# Altium project NanoVTX.PrjPcb
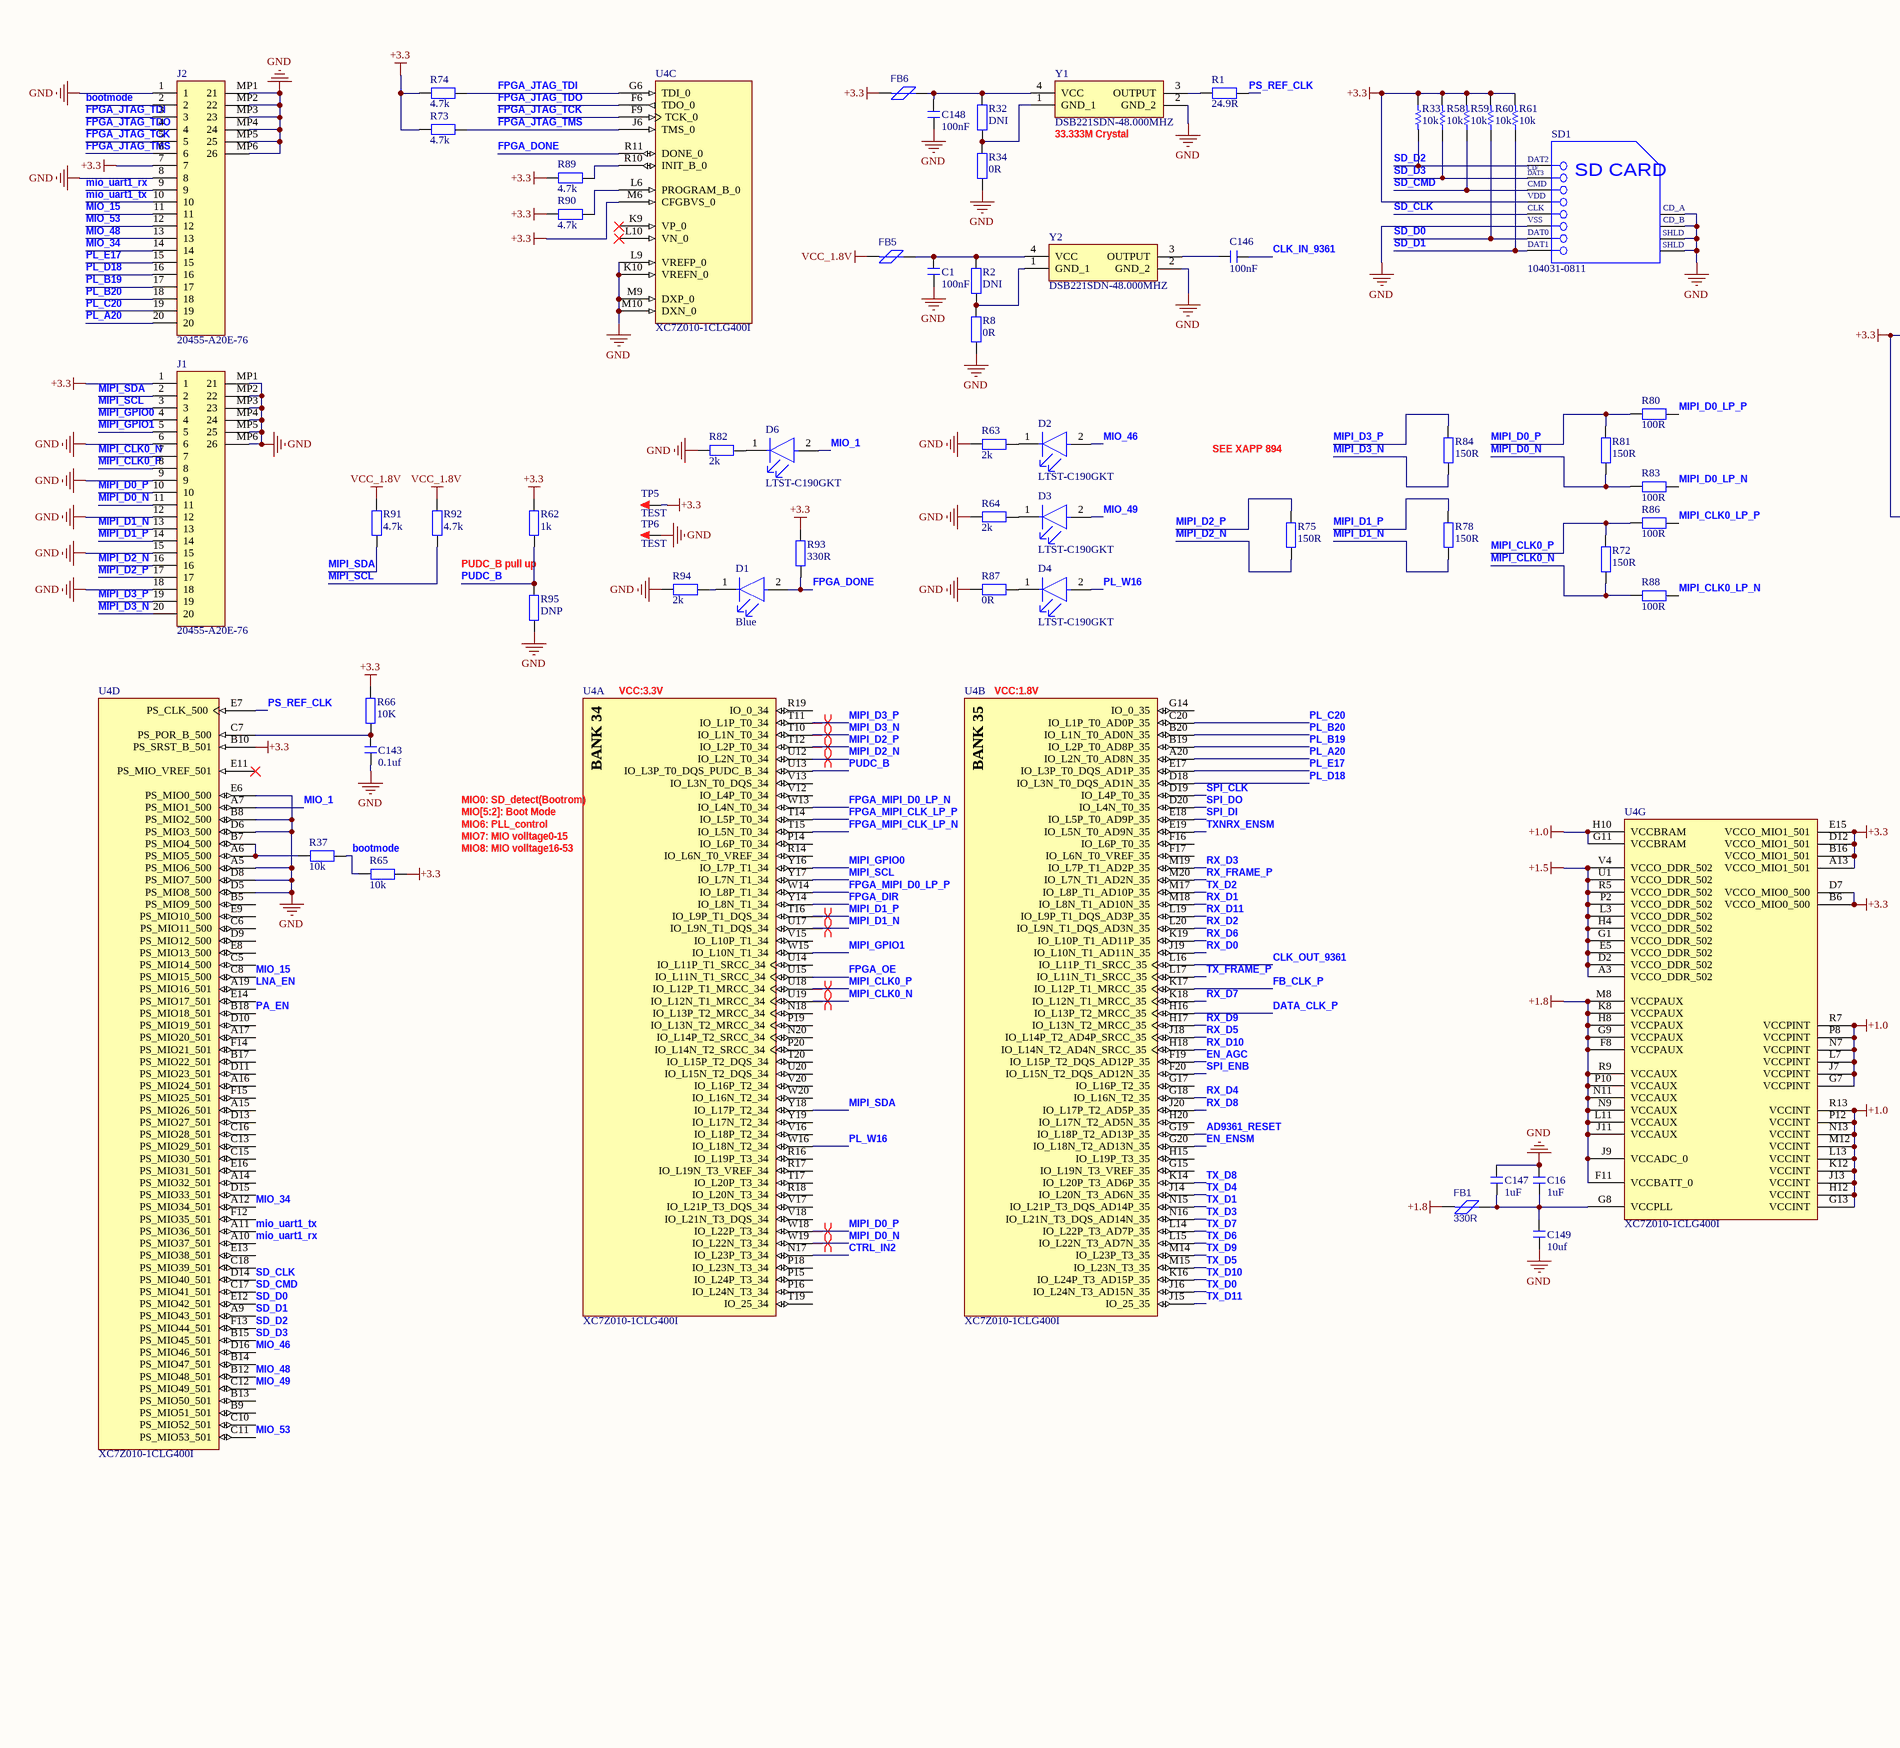
[diagram p0: CoreBoard.SchDoc, left]
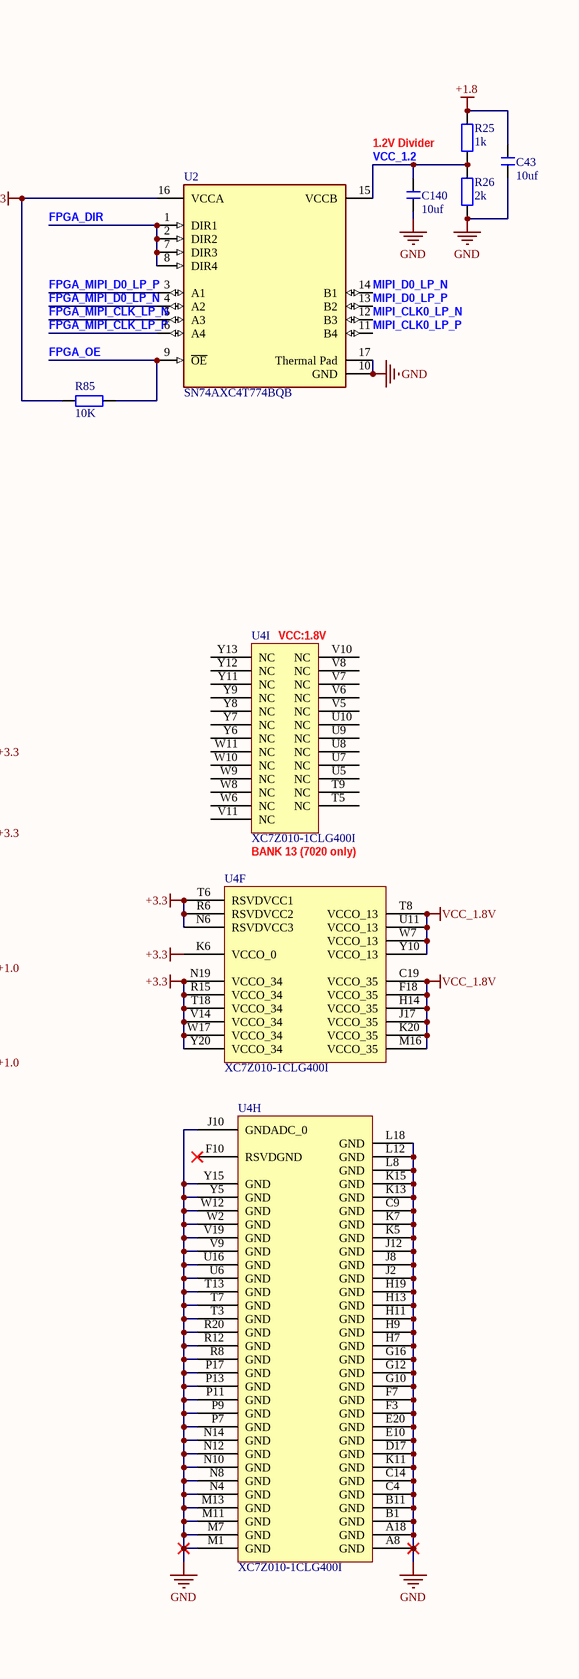
[diagram p1: CoreBoard.SchDoc, right]
5 sheets, 295 parts. Net scope: global (net labels, ports and power ports of the same name join across sheets).
Board file: OFDMT1.PcbDoc
Sheets:
  CoreBoard.SchDoc
  AD9361.SchDoc
  DDRmem.SchDoc
  Power.SchDoc
  RFFE.SchDoc

## Sheet CoreBoard.SchDoc
size C; SheetNumber: 1; SheetTotal: 5

### Parts
C1  100nF  [CAP_0402]
C16  1uF  [CAP_0201]
C43  10uf  [CAP_0402]
C140  10uf  [CAP_0402]
C143  0.1uf  [CAP_0402]
C146  100nF  [CAP_0402]
C147  1uF  [CAP_0201]
C148  100nF  [CAP_0402]
C149  10uf  [CAP_0402]
D1  Blue  [FP-LTST-C190GKT-MFG]
D2  LTST-C190GKT  [FP-LTST-C190GKT-MFG]
D3  LTST-C190GKT  [FP-LTST-C190GKT-MFG]
D4  LTST-C190GKT  [FP-LTST-C190GKT-MFG]
D6  LTST-C190GKT  [FP-LTST-C190GKT-MFG]
FB1  330R  [RES_0201]
FB5  BLM15PX331SN1D  [RES_0402]  (value not drawn)
FB6  BLM15PX331SN1D  [RES_0402]  (value not drawn)
J1  20455-A20E-76  [20455A20E76]
J2  20455-A20E-76  [20455A20E76]
R1  24.9R  [RES_0402]
R2  DNI  [RES_0402]
R8  0R  [RES_0402]
R25  1k  [RES_0402]
R26  2k  [RES_0402]
R32  DNI  [RES_0402]
R33  10k  [RES_0402]
R34  0R  [RES_0402]
R37  10k  [RES_0201]
R58  10k  [RES_0402]
R59  10k  [RES_0402]
R60  10k  [RES_0402]
R61  10k  [RES_0402]
R62  1k  [RES_0201]
R63  2k  [RES_0402]
R64  2k  [RES_0402]
R65  10k  [RES_0201]
R66  10K  [RES_0201]
R72  150R  [RES_0201]
R73  4.7k  [RES_0201]
R74  4.7k  [RES_0201]
R75  150R  [RES_0201]
R78  150R  [RES_0201]
R80  100R  [RES_0201]
R81  150R  [RES_0201]
R82  2k  [RES_0402]
R83  100R  [RES_0201]
R84  150R  [RES_0201]
R85  10K  [RES_0201]
R86  100R  [RES_0201]
R87  0R  [RES_0201]
R88  100R  [RES_0201]
R89  4.7k  [RES_0201]
R90  4.7k  [RES_0201]
R91  4.7k  [RES_0402]
R92  4.7k  [RES_0402]
R93  330R  [RES_0402]
R94  2k  [RES_0402]
R95  DNP  [RES_0201]
SD1  104031-0811  [MOLX-104031-0811_V]
TP5  TEST  [TEST 0.8]
TP6  TEST  [TEST 0.8]
U2  SN74AXC4T774BQB  [FP-BQB0016A-MFG]
U4  XC7Z010-1CLG400I  [CLG400]  (parts A,B,C,D,F,G,H,I of 9)
Y1  DSB221SDN-48.000MHZ  [DSB221SDN48000MHZ]
Y2  DSB221SDN-48.000MHZ  [DSB221SDN48000MHZ]

### Nets
+1.0: U4.G7(VCCPINT) U4.G11(VCCBRAM) U4.G13(VCCINT) U4.H10(VCCBRAM) U4.H12(VCCINT) U4.J7(VCCPINT) U4.J13(VCCINT) U4.K12(VCCINT) U4.L7(VCCPINT) U4.L13(VCCINT) U4.M12(VCCINT) U4.N7(VCCPINT) U4.N13(VCCINT) U4.P8(VCCPINT) U4.P12(VCCINT) U4.R7(VCCPINT) U4.R13(VCCINT)
+1.5: U4.A3(VCCO_DDR_502) U4.D2(VCCO_DDR_502) U4.E5(VCCO_DDR_502) U4.G1(VCCO_DDR_502) U4.H4(VCCO_DDR_502) U4.L3(VCCO_DDR_502) U4.P2(VCCO_DDR_502) U4.R5(VCCO_DDR_502) U4.U1(VCCO_DDR_502) U4.V4(VCCO_DDR_502)
+1.8: C43.1 FB1.1 FB5.1 R25.1 R91.1 R92.1 U4.C19(VCCO_35) U4.F8(VCCPAUX) U4.F11(VCCBATT_0) U4.F18(VCCO_35) U4.G9(VCCPAUX) U4.H8(VCCPAUX) U4.H14(VCCO_35) U4.J9(VCCADC_0) U4.J11(VCCAUX) U4.J17(VCCO_35) U4.K8(VCCPAUX) U4.K20(VCCO_35) U4.L11(VCCAUX) U4.M8(VCCPAUX) U4.M16(VCCO_35) U4.N9(VCCAUX) U4.N11(VCCAUX) U4.P10(VCCAUX) U4.R9(VCCAUX) U4.T8(VCCO_13) U4.U11(VCCO_13) U4.W7(VCCO_13) U4.Y10(VCCO_13)  [also labelled VCC_1.8V]
+3.3: FB6.1 J1.1 J2.7 R33.1 R58.2 R59.2 R60.2 R61.2 R62.2 R65.2 R66.2 R73.1 R74.1 R85.2 R89.2 R90.2 R93.2 SD1.4(VDD) TP5.1 U2.16(VCCA) U4.A13(VCCO_MIO1_501) U4.B6(VCCO_MIO0_500) U4.B10(PS_SRST_B_501) U4.B16(VCCO_MIO1_501) U4.D7(VCCO_MIO0_500) U4.D12(VCCO_MIO1_501) U4.E15(VCCO_MIO1_501) U4.K6(VCCO_0) U4.M6(CFGBVS_0) U4.N6(RSVDVCC3) U4.N19(VCCO_34) U4.R6(RSVDVCC2) U4.R15(VCCO_34) U4.T6(RSVDVCC1) U4.T18(VCCO_34) U4.V14(VCCO_34) U4.W17(VCCO_34) U4.Y20(VCCO_34)
GND: C1.2 C16.2 C43.2 C140.2 C143.2 C147.2 C148.1 C149.2 J1.6 J1.9 J1.12 J1.15 J1.18 J1.MP1(21) J1.MP2(22) J1.MP3(23) J1.MP4(24) J1.MP5(25) J1.MP6(26) J2.1 J2.8 J2.MP1(21) J2.MP2(22) J2.MP3(23) J2.MP4(24) J2.MP5(25) J2.MP6(26) R8.1 R26.2 R34.1 R63.1 R64.1 R82.1 R87.1 R94.1 R95.1 SD1.6(VSS2) SD1.9(CD_A) SD1.10(CD_B) SD1.11(SHLD1) SD1.12(SHLD2) TP6.1 U2.10(GND) U2.17(Thermal_Pad) U4.A5(PS_MIO6_500) U4.A8(GND) U4.A18(GND) U4.B1(GND) U4.B8(PS_MIO2_500) U4.B11(GND) U4.C4(GND) U4.C9(GND) U4.C14(GND) U4.D5(PS_MIO8_500) U4.D6(PS_MIO3_500) U4.D8(PS_MIO7_500) U4.D17(GND) U4.E6(PS_MIO0_500) U4.E10(GND) U4.E20(GND) U4.F3(GND) U4.F7(GND) U4.G10(GND) U4.G12(GND) U4.G16(GND) U4.H7(GND) U4.H9(GND) U4.H11(GND) U4.H13(GND) U4.H19(GND) U4.J2(GND) U4.J8(GND) U4.J10(GNDADC_0) U4.J12(GND) U4.K5(GND) U4.K7(GND) U4.K10(VREFN_0) U4.K11(GND) U4.K13(GND) U4.K15(GND) U4.L8(GND) U4.L9(VREFP_0) U4.L12(GND) U4.L18(GND) U4.M1(GND) U4.M7(GND) U4.M9(DXP_0) U4.M10(DXN_0) U4.M11(GND) U4.M13(GND) U4.N4(GND) U4.N8(GND) U4.N10(GND) U4.N12(GND) U4.N14(GND) U4.P7(GND) U4.P9(GND) U4.P11(GND) U4.P13(GND) U4.P17(GND) U4.R8(GND) U4.R12(GND) U4.R20(GND) U4.T3(GND) U4.T7(GND) U4.T13(GND) U4.U6(GND) U4.U16(GND) U4.V9(GND) U4.V19(GND) U4.W2(GND) U4.W12(GND) U4.Y5(GND) U4.Y15(GND) Y1.2(GND_2) Y2.2(GND_2)
AD9361_RESET: U4.G19(IO_L18P_T2_AD13P_35)
bootmode: J2.2 R37.2 R65.1
CLK_IN_9361: C146.2
CLK_OUT_9361: U4.L16(IO_L11P_T1_SRCC_35)
CTRL_IN2: U4.N17(IO_L23P_T3_34)
DATA_CLK_P: U4.H16(IO_L13P_T2_MRCC_35)
EN_AGC: U4.F19(IO_L15P_T2_DQS_AD12P_35)
EN_ENSM: U4.G20(IO_L18N_T2_AD13N_35)
FB_CLK_P: U4.K17(IO_L12P_T1_MRCC_35)
FPGA_DIR: U2.1(DIR1) U2.2(DIR2) U2.7(DIR3) U2.8(DIR4) U4.Y14(IO_L8N_T1_34)
FPGA_DONE: D1.2(A) R93.1 U4.R11(DONE_0)
FPGA_JTAG_TCK: J2.5 U4.F9(TCK_0)
FPGA_JTAG_TDI: J2.3 R74.2 U4.G6(TDI_0)
FPGA_JTAG_TDO: J2.4 U4.F6(TDO_0)
FPGA_JTAG_TMS: J2.6 R73.2 U4.J6(TMS_0)
FPGA_MIPI_CLK_LP_N: U2.5(A3) U4.T15(IO_L5N_T0_34)
FPGA_MIPI_CLK_LP_P: U2.6(A4) U4.T14(IO_L5P_T0_34)
FPGA_MIPI_D0_LP_N: U2.4(A2) U4.W13(IO_L4N_T0_34)
FPGA_MIPI_D0_LP_P: U2.3(A1) U4.W14(IO_L8P_T1_34)
FPGA_OE: R85.1 U2.9(~{OE}) U4.U15(IO_L11N_T1_SRCC_34)
LNA_EN: U4.A19(PS_MIO16_501)
MIO_1: D6.2(A) U4.A7(PS_MIO1_500)
MIO_15: J2.11 U4.C8(PS_MIO15_500)
MIO_34: J2.14 U4.A12(PS_MIO34_501)
MIO_46: D2.2(A) U4.D16(PS_MIO46_501)
MIO_48: J2.13 U4.B12(PS_MIO48_501)
MIO_49: D3.2(A) U4.C12(PS_MIO49_501)
MIO_53: J2.12 U4.C11(PS_MIO53_501)
mio_uart1_rx: J2.9 U4.A10(PS_MIO37_501)
mio_uart1_tx: J2.10 U4.A11(PS_MIO36_501)
MIPI_CLK0_LP_N: R88.2 U2.12(B3)
MIPI_CLK0_LP_P: R86.2 U2.11(B4)
MIPI_CLK0_N: J1.7 R72.2 R88.1 U4.U19(IO_L12N_T1_MRCC_34)
MIPI_CLK0_P: J1.8 R72.1 R86.1 U4.U18(IO_L12P_T1_MRCC_34)
MIPI_D0_LP_N: R83.1 U2.14(B1)
MIPI_D0_LP_P: R80.1 U2.13(B2)
MIPI_D0_N: J1.11 R81.2 R83.2 U4.W19(IO_L22N_T3_34)
MIPI_D0_P: J1.10 R80.2 R81.1 U4.W18(IO_L22P_T3_34)
MIPI_D1_N: J1.13 R78.2 U4.U17(IO_L9N_T1_DQS_34)
MIPI_D1_P: J1.14 R78.1 U4.T16(IO_L9P_T1_DQS_34)
MIPI_D2_N: J1.16 R75.2 U4.U12(IO_L2N_T0_34)
MIPI_D2_P: J1.17 R75.1 U4.T12(IO_L2P_T0_34)
MIPI_D3_N: J1.20 R84.2 U4.T10(IO_L1N_T0_34)
MIPI_D3_P: J1.19 R84.1 U4.T11(IO_L1P_T0_34)
MIPI_GPIO0: J1.4 U4.Y16(IO_L7P_T1_34)
MIPI_GPIO1: J1.5 U4.W15(IO_L10N_T1_34)
MIPI_SCL: J1.3 R92.2 U4.Y17(IO_L7N_T1_34)
MIPI_SDA: J1.2 R91.2 U4.Y18(IO_L17P_T2_34)
PA_EN: U4.B18(PS_MIO18_501)
PL_A20: J2.20 U4.A20(IO_L2N_T0_AD8N_35)
PL_B19: J2.17 U4.B19(IO_L2P_T0_AD8P_35)
PL_B20: J2.18 U4.B20(IO_L1N_T0_AD0N_35)
PL_C20: J2.19 U4.C20(IO_L1P_T0_AD0P_35)
PL_D18: J2.16 U4.D18(IO_L3N_T0_DQS_AD1N_35)
PL_E17: J2.15 U4.E17(IO_L3P_T0_DQS_AD1P_35)
PL_W16: D4.2(A) U4.W16(IO_L18N_T2_34)
PS_REF_CLK: R1.2 U4.E7(PS_CLK_500)
PUDC_B: R62.1 R95.2 U4.U13(IO_L3P_T0_DQS_PUDC_B_34)
RX_D0: U4.J19(IO_L10N_T1_AD11N_35)
RX_D1: U4.M18(IO_L8N_T1_AD10N_35)
RX_D2: U4.L20(IO_L9N_T1_DQS_AD3N_35)
RX_D3: U4.M19(IO_L7P_T1_AD2P_35)
RX_D4: U4.G18(IO_L16N_T2_35)
RX_D5: U4.J18(IO_L14P_T2_AD4P_SRCC_35)
RX_D6: U4.K19(IO_L10P_T1_AD11P_35)
RX_D7: U4.K18(IO_L12N_T1_MRCC_35)
RX_D8: U4.J20(IO_L17P_T2_AD5P_35)
RX_D9: U4.H17(IO_L13N_T2_MRCC_35)
RX_D10: U4.H18(IO_L14N_T2_AD4N_SRCC_35)
RX_D11: U4.L19(IO_L9P_T1_DQS_AD3P_35)
RX_FRAME_P: U4.M20(IO_L7N_T1_AD2N_35)
SD_CLK: SD1.5(CLK) U4.D14(PS_MIO40_501)
SD_CMD: R59.1 SD1.3(VSS1) U4.C17(PS_MIO41_501)
SD_D0: R60.1 SD1.7(DAT0) U4.E12(PS_MIO42_501)
SD_D1: R61.1 SD1.8(DAT1) U4.A9(PS_MIO43_501)
SD_D2: R33.2 SD1.1(CD/DAT3) U4.F13(PS_MIO44_501)
SD_D3: R58.1 SD1.2(CMD) U4.B15(PS_MIO45_501)
SPI_CLK: U4.D19(IO_L4P_T0_35)
SPI_DI: U4.E18(IO_L5P_T0_AD9P_35)
SPI_DO: U4.D20(IO_L4N_T0_35)
SPI_ENB: U4.F20(IO_L15N_T2_DQS_AD12N_35)
TX_D0: U4.J16(IO_L24N_T3_AD15N_35)
TX_D1: U4.N15(IO_L21P_T3_DQS_AD14P_35)
TX_D2: U4.M17(IO_L8P_T1_AD10P_35)
TX_D3: U4.N16(IO_L21N_T3_DQS_AD14N_35)
TX_D4: U4.J14(IO_L20N_T3_AD6N_35)
TX_D5: U4.M15(IO_L23N_T3_35)
TX_D6: U4.L15(IO_L22N_T3_AD7N_35)
TX_D7: U4.L14(IO_L22P_T3_AD7P_35)
TX_D8: U4.K14(IO_L20P_T3_AD6P_35)
TX_D9: U4.M14(IO_L23P_T3_35)
TX_D10: U4.K16(IO_L24P_T3_AD15P_35)
TX_D11: U4.J15(IO_25_35)
TX_FRAME_P: U4.L17(IO_L11N_T1_SRCC_35)
TXNRX_ENSM: U4.E19(IO_L5N_T0_AD9N_35)
VCC_1.2: C140.1 R25.2 R26.1 U2.15(VCCB)
NetC1_1: C1.1 FB5.2 R2.2 Y2.4(VCC)
NetC16_1: C16.1 C147.1 C149.1 FB1.2 U4.G8(VCCPLL)
NetC143_1: C143.1 R66.1 U4.C7(PS_POR_B_500)
NetC146_1: C146.1 Y2.3(OUTPUT)
NetC148_2: C148.2 FB6.2 R32.2 Y1.4(VCC)
NetD1_1: D1.1(C) R94.2
NetD2_1: D2.1(C) R63.2
NetD3_1: D3.1(C) R64.2
NetD4_1: D4.1(C) R87.2
NetD6_1: D6.1(C) R82.2
NetR1_1: R1.1 Y1.3(OUTPUT)
NetR2_1: R2.1 R8.2 Y2.1(GND_1)
NetR32_1: R32.1 R34.2 Y1.1(GND_1)
NetR37_1: R37.1 U4.A6(PS_MIO5_500) U4.B7(PS_MIO4_500)
NetR89_1: R89.1 U4.R10(INIT_B_0)
NetR90_1: R90.1 U4.L6(PROGRAM_B_0)

Not connected (* = marked no-connect by the designer): U4 A14(PS_MIO32_501) A15(PS_MIO26_501) A16(PS_MIO24_501) A17(PS_MIO20_501) B5(PS_MIO9_500) B9(PS_MIO51_501) B13(PS_MIO50_501) B14(PS_MIO47_501) B17(PS_MIO22_501) C5(PS_MIO14_500) C6(PS_MIO11_500) C10(PS_MIO52_501) C13(PS_MIO29_501) C15(PS_MIO30_501) C16(PS_MIO28_501) C18(PS_MIO39_501) D9(PS_MIO12_500) D10(PS_MIO19_501) D11(PS_MIO23_501) D13(PS_MIO27_501) D15(PS_MIO33_501) E8(PS_MIO13_500) E9(PS_MIO10_500) E11(PS_MIO_VREF_501)* E13(PS_MIO38_501) E14(PS_MIO17_501) E16(PS_MIO31_501) F10(RSVDGND)* F12(PS_MIO35_501) F14(PS_MIO21_501) F15(PS_MIO25_501) F16(IO_L6P_T0_35) F17(IO_L6N_T0_VREF_35) G14(IO_0_35) G15(IO_L19N_T3_VREF_35) G17(IO_L16P_T2_35) H15(IO_L19P_T3_35) H20(IO_L17N_T2_AD5N_35) K9(VP_0)* L10(VN_0)* N18(IO_L13P_T2_MRCC_34) N20(IO_L14P_T2_SRCC_34) P14(IO_L6P_T0_34) P15(IO_L24P_T3_34) P16(IO_L24N_T3_34) P18(IO_L23N_T3_34) P19(IO_L13N_T2_MRCC_34) P20(IO_L14N_T2_SRCC_34) R14(IO_L6N_T0_VREF_34) R16(IO_L19P_T3_34) R17(IO_L19N_T3_VREF_34) R18(IO_L20N_T3_34) R19(IO_0_34) T5(NC) T9(NC) T17(IO_L20P_T3_34) T19(IO_25_34) T20(IO_L15P_T2_DQS_34) U5(NC) U7(NC) U8(NC) U9(NC) U10(NC) U14(IO_L11P_T1_SRCC_34) U20(IO_L15N_T2_DQS_34) V5(NC) V6(NC) V7(NC) V8(NC) V10(NC) V11(NC) V12(IO_L4P_T0_34) V13(IO_L3N_T0_DQS_34) V15(IO_L10P_T1_34) V16(IO_L18P_T2_34) V17(IO_L21P_T3_DQS_34) V18(IO_L21N_T3_DQS_34) V20(IO_L16P_T2_34) W6(NC) W8(NC) W9(NC) W10(NC) W11(NC) W20(IO_L16N_T2_34) Y6(NC) Y7(NC) Y8(NC) Y9(NC) Y11(NC) Y12(NC) Y13(NC) Y19(IO_L17N_T2_34)

### Layout directives
differential pair: MIPI_CLK0_N, MIPI_CLK0_P, MIPI_D0_N, MIPI_D0_P, MIPI_D1_N, MIPI_D1_P, MIPI_D2_N, MIPI_D2_P, MIPI_D3_N, MIPI_D3_P

### Notes on the sheet
- (near Y1) 33.333M Crystal
- 1.2V Divider
- SEE XAPP 894
- PUDC_B pull up
- VCC:3.3V
- VCC:1.8V
- (near U4) VCC:1.8V
- MIO7: MIO volltage0-15
- MIO6: PLL_control
- MIO0: SD_detect(Bootrom)
- MIO[5:2]: Boot Mode
- MIO8: MIO volltage16-53
- (near U4) BANK 13 (7020 only)
- (in symbol CMP-0363-00008-3, part A) BANK 34
- (in symbol CMP-0363-00008-3, part B) BANK 35
- (in symbol CMP-2000-05825-1) DAT2; CD/; DAT3; SD CARD; VSS; SHLD

### Library data of the parts
C1 C16 C43 C140 C143 C146-C149 = C: 无极性贴片电容; 版权归属: 源创客; BOM名称: 无极性贴片电容; 学习资源: www.ooocke.com
D1-D4 D6 = CMP-22017-000005-2: LED GREEN CLEAR CHIP SMD; Dominant Wavelength: 569nm; Reverse Voltage: 5V; Lens Color: Colorless; Viewing Angle: 130°; Voltage: 2V; Forward Current: 30mA; Power Dissipation: 100mW; Luminous Intensity: 6mcd; Number of LEDs: 1; Forward Voltage: 2.1V; Wavelength: 565nm; Test Current: 10mA; Min Operating Temperature: -55°C; Lens Style: Clear; Mount: Surface Mount; Width: 0.8mm; Packaging: Tape and Reel; Lens Transparency: Clear; Case Code (Metric): 1608; Depth: 0.8mm; Case Code (Imperial): 0603; Case/Package: 0603; Number of Pins: 2; Max Operating Temperature: 85°C; Lead Free: Lead Free; Number of Elements: 1; Length: 1.6mm; Height: 0.8mm; Package Quantity: 1; Power Rating: 100mW; Radiation Hardening: No; Illumination Color: Green; Color: Green
FB1 FB5 FB6 = BLM15PX331SN1D: 330 Ohms @ 100 MHz 1 Power Line Ferrite Bead 0402 (1005 Metric) 1.2A 150mOhm from Murata Electronics; Contributor: LCSC; BOM_Supplier: LCSC; BOM_Supplier Part: C160975; BOM_Manufacturer: Murata Electronics; BOM_Manufacturer Part: BLM15PX331SN1D; spicePre: U; spiceSymbolName: BLM15PX331SN1D
J1 J2 = 20455-A20E-76: Connector; Manufacturer_Name: I-Pex; Datasheet Link: https://www.i-pex.com/sites/default/files/downloads/pdf/2D_CABLINE-VS_RECEPTACLE_20455C30.pdf; Height: 1.1mm; Manufacturer_Part_Number: 20455-A20E-76
R1 R2 R8 R25 R26 R32 R34 R37 R62-R66 R72-R75 R78 R80-R95 = R: 贴片电阻; 版权归属: 源创客; BOM名称: 贴片电阻; 学习资源: www.ooocke.com
R33 R58-R61 = RES
SD1 = CMP-2000-05825-1: Micro SD Card, RA, -25 to 85 degC, 8-Pin SMD, RoHS, Tape and Reel; Voltage Rating: 10VAC/DC; Number of Contacts: 8; Insertion - Extraction Style: Push-Pull; Pitch: 1.1mm; Mating Cycles: 10000; Brand: Molex; Current Rating: 500mA; Manufacturer URL: http://www.molex.com/; Card Type: microSD; Mounting Type: Standard; Height: 1.42mm; Mounting Technology: SurfaceMount; Contact Plating: Gold; Product Category: MemoryCardConnectors; Package Description: 8-Pin Surface Mount Device, Body 11.95 x 11.4 mm, Pitch 1.1 mm; Datasheet URL: http://www.molex.com/pdm_docs/sd/1040310811_sd.pdf; Termination Style: SMD; Length: 11.4mm; Housing Material: LiquidCrystalPolymer(LCP); Orientation: RightAngle; RoHS: True; Contact Material: PhosphorBronze; Datasheet Version: Rev. E, 04/2006; Packaging: Reel; Manufacturer: Molex; Series: 104031; Product: CardConnectors; Number of Rows: 1Row; Package Reference: 104031-0811
TP5 TP6 = TEST: 测试点; 版权归属: 源创客; BOM名称: 测试点; 学习资源: www.ooocke.com
U2 = CMP-04899-000100-1: IC TRANSCEIVER HALF 4/4 16WQFN
U4 = CMP-0363-00008-3: 667 MHz Zynq™-7000 AP SoC, 130 PS I/O, 100 FPGA I/O, 400-Ball BGA, Speed Grade 1, Industrial Grade, Pb-Free; Speed Grade: -1; LUTs: 17600; Extensible Block RAM (# 36Kb Blocks): 240 KB (60); Flip Flops: 35200; PartNumber: XC7Z010-1CLG400I; Mounting Technology: Surface Mount; ComponentLink5URL: http://www.xilinx.com/support/documentation/user_guides/ug865-Zynq-7000-Pkg-Pinout.pdf; ComponentLink3URL: http://www.xilinx.com/support/documentation/data_sheets/ds187-XC7Z010-XC7Z020-Data-Sheet.pdf; PackageVersion: Rev 1.1, 09/2012; ComponentLink2Description: Package Specification; ComponentLink4Description: Package File; ComponentLink2URL: http://www.xilinx.com/support/documentation/user_guides/ug865-Zynq-7000-Pkg-Pinout.pdf; ComponentLink3Description: DC and AC Switching Characteristics; ComponentLink6Description: PCB and Layout Guide; ComponentLink4URL: http://www.xilinx.com/support/packagefiles/z7packages/xc7z010clg400pkg.txt; ComponentLink1URL: http://www.xilinx.com/support/documentation/data_sheets/ds190-Zynq-7000-Overview.pdf; Generic Part Number: XC7Z010; PackageReference: CLG400; ComponentLink1Description: Datasheet; RoHS: Pb-Free; ComponentLink6URL: http://www.xilinx.com/support/documentation/user_guides/ug483_7Series_PCB.pdf; DatasheetVersion: v1.2; PackageDescription: Wire-Bond Chip-Scale BGA, Body 17 x 17 mm, 0.8 mm Pitch; ComponentLink5Description: Packaging and Pinout; Code_JEDEC: MO-275-MMAA-1
Y1 Y2 = DSB221SDN-48.000MHZ: Crystal or Oscillator; Manufacturer_Name: Daishinku; Datasheet Link: http://ftp.kds.info/products/DSA_DSBxxxSDN_SDNB_en.pdf; Height: 0.9mm; Manufacturer_Part_Number: DSB221SDN-48.000MHZ

## Sheet AD9361.SchDoc
size B; SheetNumber: 2; SheetTotal: 5
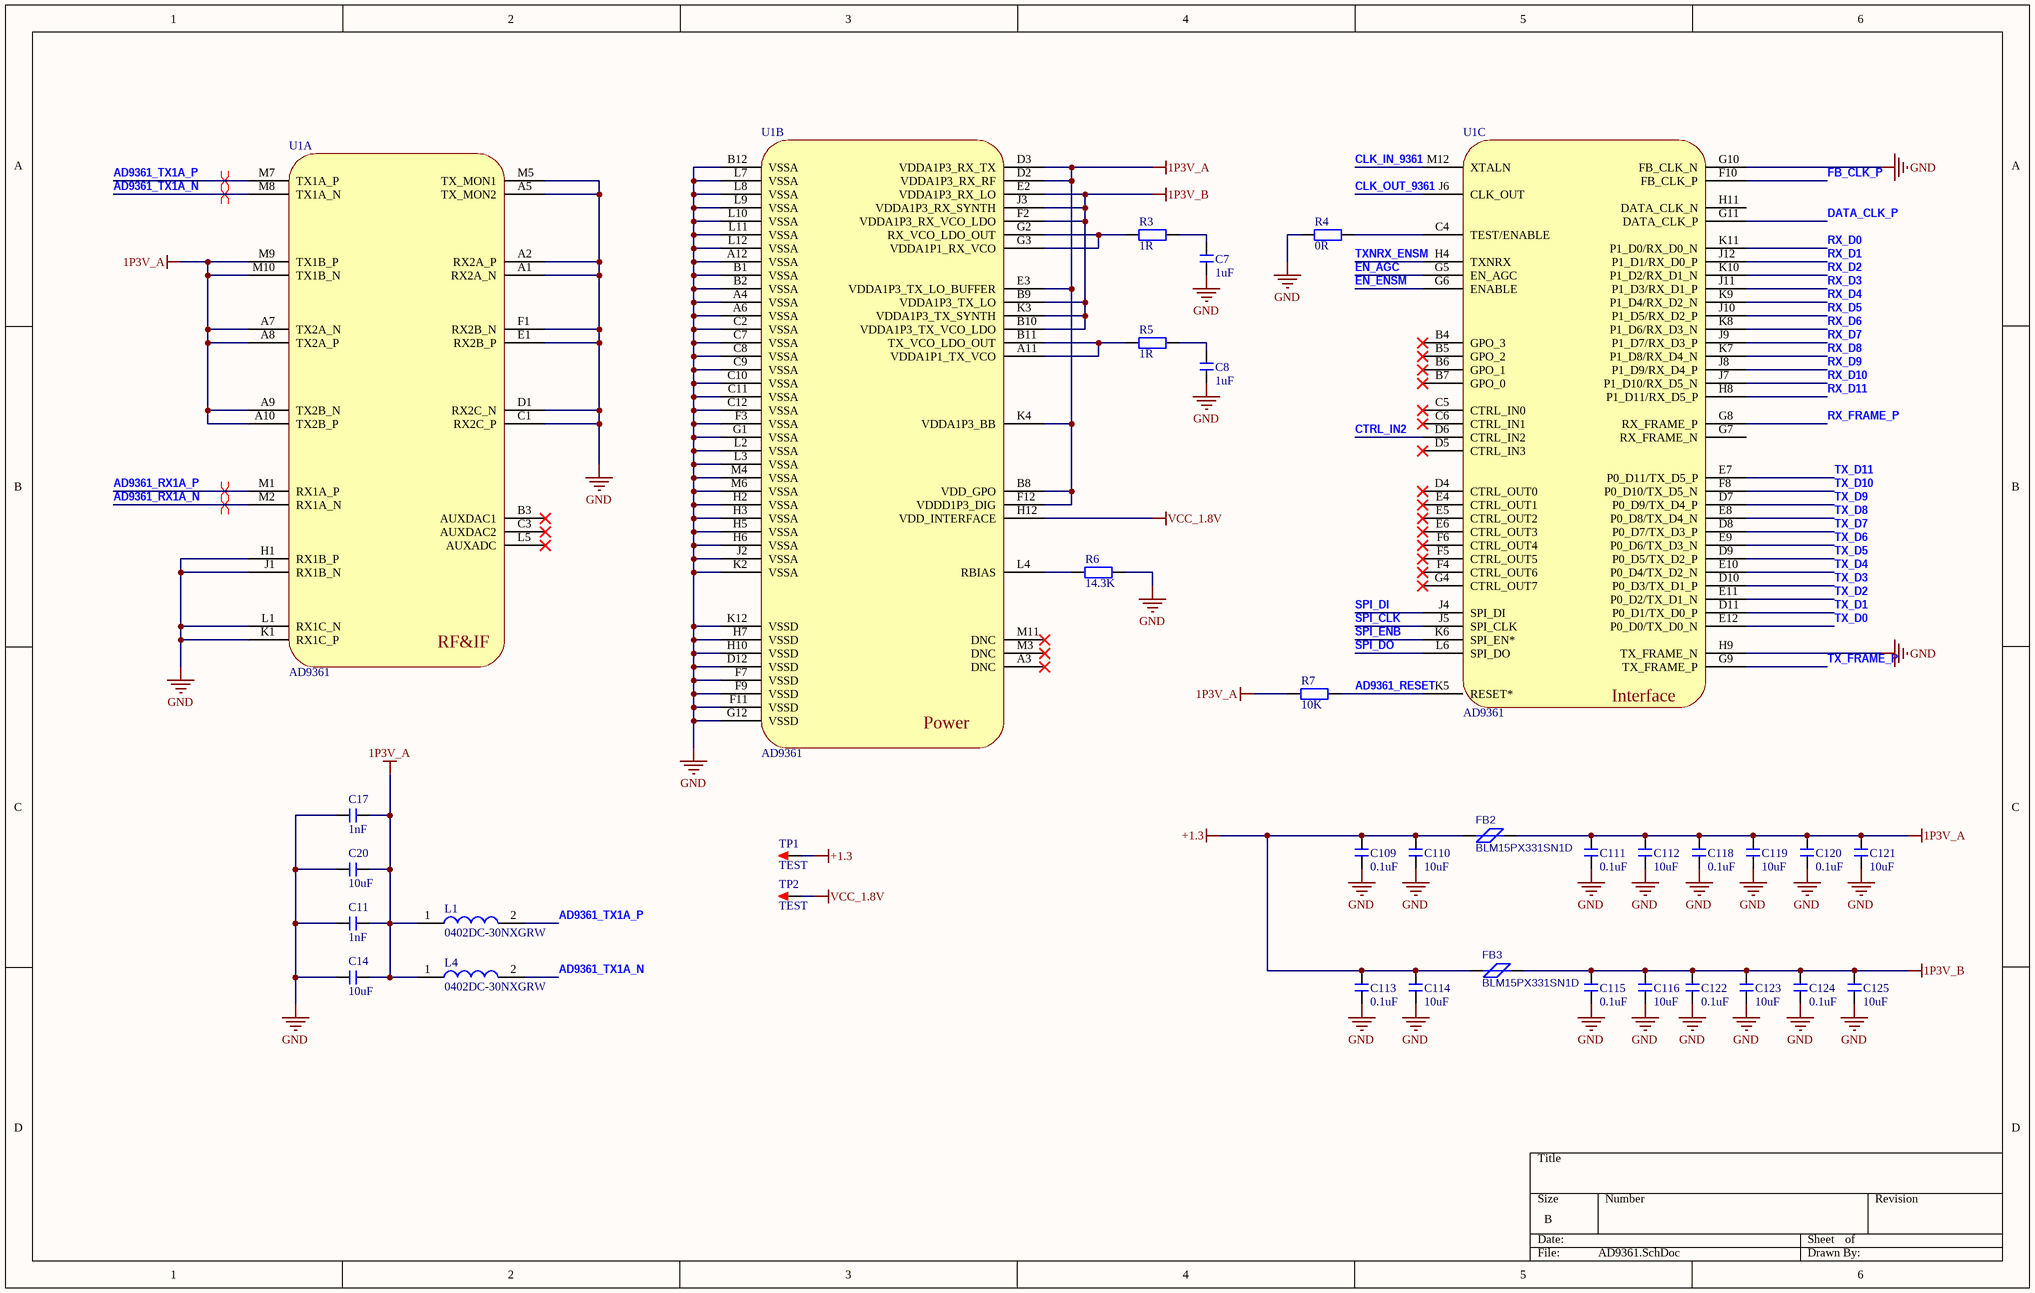
[diagram p2: AD9361.SchDoc]

### Parts
C7  1uF  [CAP_0402]
C8  1uF  [CAP_0402]
C11  1nF  [CAP_0201]
C14  10uF  [CAP_0402]
C17  1nF  [CAP_0201]
C20  10uF  [CAP_0402]
C109  0.1uF  [CAP_0402]
C110  10uF  [CAP_0402]
C111  0.1uF  [CAP_0201]
C112  10uF  [CAP_0201]
C113  0.1uF  [CAP_0402]
C114  10uF  [CAP_0402]
C115  0.1uF  [CAP_0201]
C116  10uF  [CAP_0201]
C118  0.1uF  [CAP_0201]
C119  10uF  [CAP_0201]
C120  0.1uF  [CAP_0201]
C121  10uF  [CAP_0201]
C122  0.1uF  [CAP_0201]
C123  10uF  [CAP_0201]
C124  0.1uF  [CAP_0201]
C125  10uF  [CAP_0201]
FB2  BLM15PX331SN1D  [RES_0402]
FB3  BLM15PX331SN1D  [RES_0402]
L1  0402DC-30NXGRW  [0402DC SERIES]
L4  0402DC-30NXGRW  [0402DC SERIES]
R3  value 1R  [RES_0201]  (hidden comment: Resistor)
R4  value 0R  [RES_0201]  (hidden comment: Resistor)
R5  value 1R  [RES_0402]  (hidden comment: Resistor)
R6  value 14.3K  [RES_0402]  (hidden comment: Resistor)
R7  value 10K  [RES_0201]  (hidden comment: Resistor)
TP1  TEST  [TEST 0.8]
TP2  TEST  [TEST 0.8]
U1  AD9361  [AD936X]  (parts A,B,C of 3)

### Nets
1P3V_A: C11.2 C14.2 C17.2 C20.2 C111.1 C112.2 C118.1 C119.2 C120.1 C121.2 FB2.2 L1.1 L4.1 R7.2 U1.A7(TX2A_N) U1.A8(TX2A_P) U1.A9(TX2B_N) U1.A10(TX2B_P) U1.B8(VDD_GPO) U1.D2(VDDA1P3_RX_RF) U1.D3(VDDA1P3_RX_TX) U1.E3(VDDA1P3_TX_LO_BUFFER) U1.F12(VDDD1P3_DIG) U1.K4(VDDA1P3_BB) U1.M9(TX1B_P) U1.M10(TX1B_N)
1P3V_B: C115.1 C116.2 C122.1 C123.2 C124.1 C125.2 FB3.2 U1.B9(VDDA1P3_TX_LO) U1.B10(VDDA1P3_TX_VCO_LDO) U1.E2(VDDA1P3_RX_LO) U1.F2(VDDA1P3_RX_VCO_LDO) U1.J3(VDDA1P3_RX_SYNTH) U1.K3(VDDA1P3_TX_SYNTH)
+1.3: C109.1 C110.2 C113.1 C114.2 FB2.1 FB3.1 TP1.1
GND: C7.1 C8.1 C11.1 C14.1 C17.1 C20.1 C109.2 C110.1 C111.2 C112.1 C113.2 C114.1 C115.2 C116.1 C118.2 C119.1 C120.2 C121.1 C122.2 C123.1 C124.2 C125.1 R4.2 R6.1 U1.A1(RX2A_N) U1.A2(RX2A_P) U1.A4(VSSA) U1.A5(TX_MON2) U1.A6(VSSA) U1.A12(VSSA) U1.B1(VSSA) U1.B2(VSSA) U1.B12(VSSA) U1.C1(RX2C_P) U1.C2(VSSA) U1.C7(VSSA) U1.C8(VSSA) U1.C9(VSSA) U1.C10(VSSA) U1.C11(VSSA) U1.C12(VSSA) U1.D1(RX2C_N) U1.D12(VSSD) U1.E1(RX2B_P) U1.F1(RX2B_N) U1.F3(VSSA) U1.F7(VSSD) U1.F9(VSSD) U1.F11(VSSD) U1.G1(VSSA) U1.G10(FB_CLK_N) U1.G12(VSSD) U1.H1(RX1B_P) U1.H2(VSSA) U1.H3(VSSA) U1.H5(VSSA) U1.H6(VSSA) U1.H7(VSSD) U1.H9(TX_FRAME_N) U1.H10(VSSD) U1.J1(RX1B_N) U1.J2(VSSA) U1.K1(RX1C_P) U1.K2(VSSA) U1.K12(VSSD) U1.L1(RX1C_N) U1.L2(VSSA) U1.L3(VSSA) U1.L7(VSSA) U1.L8(VSSA) U1.L9(VSSA) U1.L10(VSSA) U1.L11(VSSA) U1.L12(VSSA) U1.M4(VSSA) U1.M5(TX_MON1) U1.M6(VSSA)
VCC_1.8V: TP2.1 U1.H12(VDD_INTERFACE)  [project net +1.8]
AD9361_RESET: R7.1 U1.K5(RESET*)
AD9361_RX1A_N: U1.M2(RX1A_N)
AD9361_RX1A_P: U1.M1(RX1A_P)
AD9361_TX1A_N: L4.2 U1.M8(TX1A_N)
AD9361_TX1A_P: L1.2 U1.M7(TX1A_P)
CLK_IN_9361: U1.M12(XTALN)
CLK_OUT_9361: U1.J6(CLK_OUT)
CTRL_IN2: U1.D6(CTRL_IN2)
DATA_CLK_P: U1.G11(DATA_CLK_P)
EN_AGC: U1.G5(EN_AGC)
EN_ENSM: U1.G6(ENABLE)
FB_CLK_P: U1.F10(FB_CLK_P)
RX_D0: U1.K11(P1_D0/RX_D0_N)
RX_D1: U1.J12(P1_D1/RX_D0_P)
RX_D2: U1.K10(P1_D2/RX_D1_N)
RX_D3: U1.J11(P1_D3/RX_D1_P)
RX_D4: U1.K9(P1_D4/RX_D2_N)
RX_D5: U1.J10(P1_D5/RX_D2_P)
RX_D6: U1.K8(P1_D6/RX_D3_N)
RX_D7: U1.J9(P1_D7/RX_D3_P)
RX_D8: U1.K7(P1_D8/RX_D4_N)
RX_D9: U1.J8(P1_D9/RX_D4_P)
RX_D10: U1.J7(P1_D10/RX_D5_N)
RX_D11: U1.H8(P1_D11/RX_D5_P)
RX_FRAME_P: U1.G8(RX_FRAME_P)
SPI_CLK: U1.J5(SPI_CLK)
SPI_DI: U1.J4(SPI_DI)
SPI_DO: U1.L6(SPI_DO)
SPI_ENB: U1.K6(SPI_EN*)
TX_D0: U1.E12(P0_D0/TX_D0_N)
TX_D1: U1.D11(P0_D1/TX_D0_P)
TX_D2: U1.E11(P0_D2/TX_D1_N)
TX_D3: U1.D10(P0_D3/TX_D1_P)
TX_D4: U1.E10(P0_D4/TX_D2_N)
TX_D5: U1.D9(P0_D5/TX_D2_P)
TX_D6: U1.E9(P0_D6/TX_D3_N)
TX_D7: U1.D8(P0_D7/TX_D3_P)
TX_D8: U1.E8(P0_D8/TX_D4_N)
TX_D9: U1.D7(P0_D9/TX_D4_P)
TX_D10: U1.F8(P0_D10/TX_D5_N)
TX_D11: U1.E7(P0_D11/TX_D5_P)
TX_FRAME_P: U1.G9(TX_FRAME_P)
TXNRX_ENSM: U1.H4(TXNRX)
NetC7_2: C7.2 R3.1
NetC8_2: C8.2 R5.1
NetR3_2: R3.2 U1.G2(RX_VCO_LDO_OUT) U1.G3(VDDA1P1_RX_VCO)
NetR4_1: R4.1 U1.C4(TEST/ENABLE)
NetR5_2: R5.2 U1.A11(VDDA1P1_TX_VCO) U1.B11(TX_VCO_LDO_OUT)
NetR6_2: R6.2 U1.L4(RBIAS)

Not connected (* = marked no-connect by the designer): U1 A3(DNC)* B3(AUXDAC1)* B4(GPO_3)* B5(GPO_2)* B6(GPO_1)* B7(GPO_0)* C3(AUXDAC2)* C5(CTRL_IN0)* C6(CTRL_IN1)* D4(CTRL_OUT0)* D5(CTRL_IN3)* E4(CTRL_OUT1)* E5(CTRL_OUT2)* E6(CTRL_OUT3)* F4(CTRL_OUT6)* F5(CTRL_OUT5)* F6(CTRL_OUT4)* G4(CTRL_OUT7)* G7(RX_FRAME_N) H11(DATA_CLK_N) L5(AUXADC)* M3(DNC)* M11(DNC)*

### Layout directives
differential pair: AD9361_RX1A_N, AD9361_RX1A_P, AD9361_TX1A_N, AD9361_TX1A_P

### Notes on the sheet
- (in symbol AD9363, part A) RF&IF
- (in symbol AD9363, part B) Power
- (in symbol AD9363, part C) Interface

### Library data of the parts
C7 C8 C11 C14 C17 C20 C109-C116 C118-C125 = C: 无极性贴片电容; 版权归属: 源创客; BOM名称: 无极性贴片电容; 学习资源: www.ooocke.com
FB2 FB3 = BLM15PX331SN1D: as FB1 on sheet CoreBoard; BOM_Supplier: LCSC; BOM_Supplier Part: C160975; BOM_Manufacturer: Murata Electronics; BOM_Manufacturer Part: BLM15PX331SN1D; spicePre: U; spiceSymbolName: BLM15PX331SN1D
L1 L4 = 0402DC-36NXJRW: Inductor; Manufacturer_Name: COILCRAFT; Datasheet Link: https://componentsearchengine.com/Datasheets/1/0402DC-36NXJRW.pdf; Height: 0.65mm; Manufacturer_Part_Number: 0402DC-36NXJRW; Mouser Part Number: 994-0402DC-36NXJRW; Mouser Price/Stock: https://www.mouser.co.uk/ProductDetail/Coilcraft/0402DC-36NXJRW?qs=wnTfsH77Xs5b4nmRQW6u0w%3D%3D
TP1 TP2 = TEST: 测试点; 版权归属: 源创客; BOM名称: 测试点; 学习资源: www.ooocke.com
U1 = AD9363

## Sheet DDRmem.SchDoc
size B; SheetNumber: 3; SheetTotal: 5
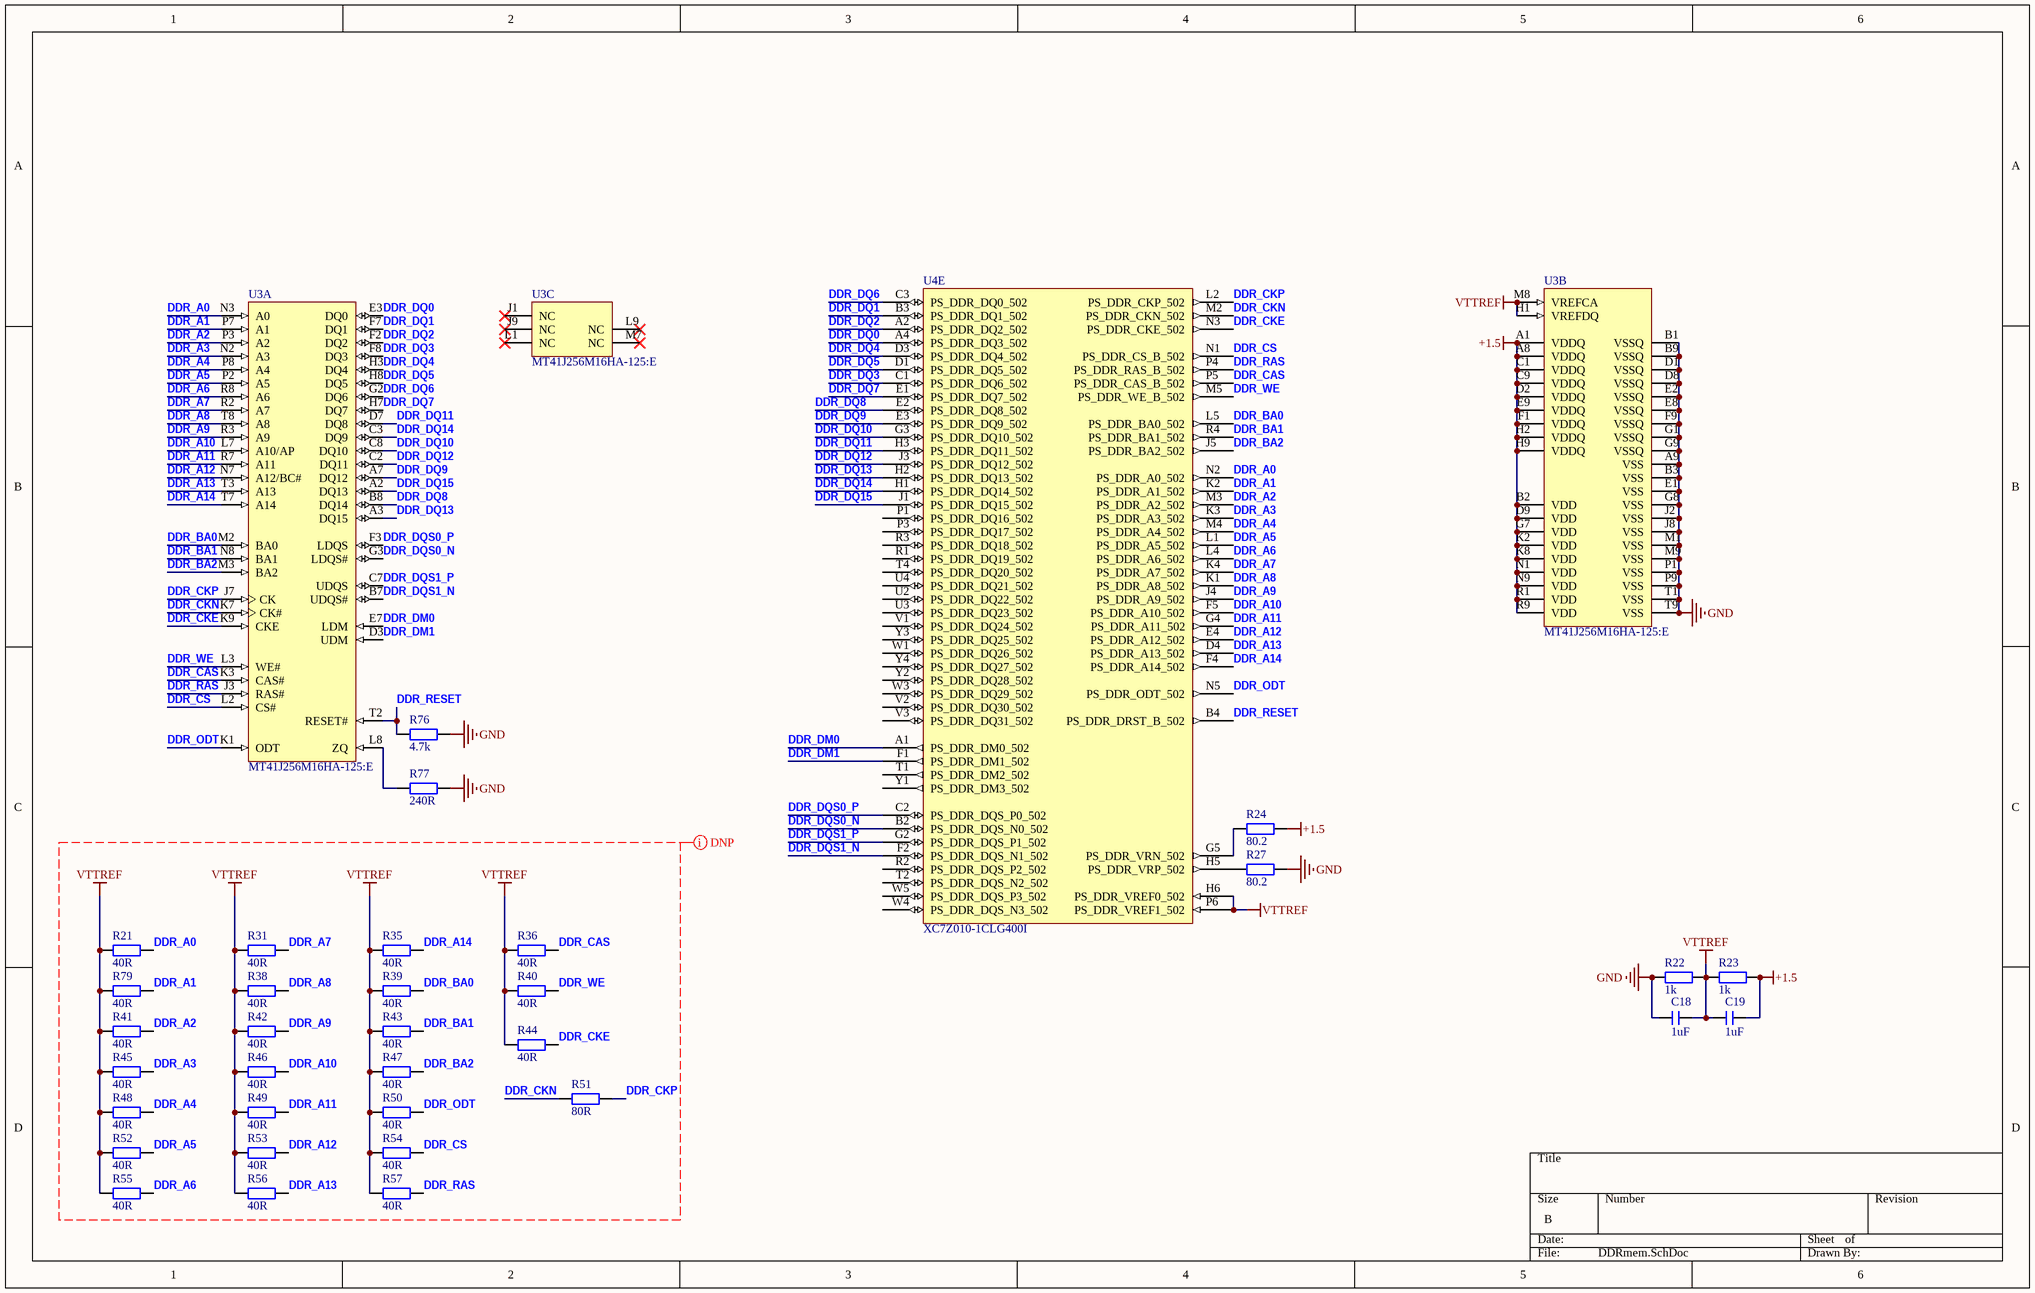
[diagram p3: DDRmem.SchDoc]

### Parts
C18  1uF  [CAP_0201]
C19  1uF  [CAP_0201]
R21  40R  [RES_0201]
R22  1k  [RES_0201]
R23  1k  [RES_0201]
R24  80.2  [RES_0201]
R27  80.2  [RES_0201]
R31  40R  [RES_0201]
R35  40R  [RES_0201]
R36  40R  [RES_0201]
R38  40R  [RES_0201]
R39  40R  [RES_0201]
R40  40R  [RES_0201]
R41  40R  [RES_0201]
R42  40R  [RES_0201]
R43  40R  [RES_0201]
R44  40R  [RES_0201]
R45  40R  [RES_0201]
R46  40R  [RES_0201]
R47  40R  [RES_0201]
R48  40R  [RES_0201]
R49  40R  [RES_0201]
R50  40R  [RES_0201]
R51  80R  [RES_0201]
R52  40R  [RES_0201]
R53  40R  [RES_0201]
R54  40R  [RES_0201]
R55  40R  [RES_0201]
R56  40R  [RES_0201]
R57  40R  [RES_0201]
R76  4.7k  [RES_0402]
R77  240R  [RES_0201]
R79  40R  [RES_0201]
U3  MT41J256M16HA-125:E  [MICT-HA-96]  (parts A,B,C of 3)
U4  XC7Z010-1CLG400I  [CLG400]  (part E of 9)

### Nets
+1.5: C19.1 R23.1 R24.1 U3.A1(VDDQ) U3.A8(VDDQ) U3.B2(VDD) U3.C1(VDDQ) U3.C9(VDDQ) U3.D2(VDDQ) U3.D9(VDD) U3.E9(VDDQ) U3.F1(VDDQ) U3.G7(VDD) U3.H2(VDDQ) U3.H9(VDDQ) U3.K2(VDD) U3.K8(VDD) U3.N1(VDD) U3.N9(VDD) U3.R1(VDD) U3.R9(VDD)
GND: C18.2 R22.2 R27.1 R76.1 R77.1 U3.A9(VSS) U3.B1(VSSQ) U3.B3(VSS) U3.B9(VSSQ) U3.D1(VSSQ) U3.D8(VSSQ) U3.E1(VSS) U3.E2(VSSQ) U3.E8(VSSQ) U3.F9(VSSQ) U3.G1(VSSQ) U3.G8(VSS) U3.G9(VSSQ) U3.J2(VSS) U3.J8(VSS) U3.M1(VSS) U3.M9(VSS) U3.P1(VSS) U3.P9(VSS) U3.T1(VSS) U3.T9(VSS)
VTTREF: C18.1 C19.2 R21.2 R22.1 R23.2 R31.2 R35.2 R36.2 R38.2 R39.2 R40.2 R41.2 R42.2 R43.2 R44.2 R45.2 R46.2 R47.2 R48.2 R49.2 R50.2 R52.2 R53.2 R54.2 R55.2 R56.2 R57.2 R79.2 U3.H1(VREFDQ) U3.M8(VREFCA) U4.H6(PS_DDR_VREF0_502) U4.P6(PS_DDR_VREF1_502)
DDR_A0: R21.1 U3.N3(A0) U4.N2(PS_DDR_A0_502)
DDR_A1: R79.1 U3.P7(A1) U4.K2(PS_DDR_A1_502)
DDR_A2: R41.1 U3.P3(A2) U4.M3(PS_DDR_A2_502)
DDR_A3: R45.1 U3.N2(A3) U4.K3(PS_DDR_A3_502)
DDR_A4: R48.1 U3.P8(A4) U4.M4(PS_DDR_A4_502)
DDR_A5: R52.1 U3.P2(A5) U4.L1(PS_DDR_A5_502)
DDR_A6: R55.1 U3.R8(A6) U4.L4(PS_DDR_A6_502)
DDR_A7: R31.1 U3.R2(A7) U4.K4(PS_DDR_A7_502)
DDR_A8: R38.1 U3.T8(A8) U4.K1(PS_DDR_A8_502)
DDR_A9: R42.1 U3.R3(A9) U4.J4(PS_DDR_A9_502)
DDR_A10: R46.1 U3.L7(A10/AP) U4.F5(PS_DDR_A10_502)
DDR_A11: R49.1 U3.R7(A11) U4.G4(PS_DDR_A11_502)
DDR_A12: R53.1 U3.N7(A12/BC#) U4.E4(PS_DDR_A12_502)
DDR_A13: R56.1 U3.T3(A13) U4.D4(PS_DDR_A13_502)
DDR_A14: R35.1 U3.T7(A14) U4.F4(PS_DDR_A14_502)
DDR_BA0: R39.1 U3.M2(BA0) U4.L5(PS_DDR_BA0_502)
DDR_BA1: R43.1 U3.N8(BA1) U4.R4(PS_DDR_BA1_502)
DDR_BA2: R47.1 U3.M3(BA2) U4.J5(PS_DDR_BA2_502)
DDR_CAS: R36.1 U3.K3(CAS#) U4.P5(PS_DDR_CAS_B_502)
DDR_CKE: R44.1 U3.K9(CKE) U4.N3(PS_DDR_CKE_502)
DDR_CKN: R51.2 U3.K7(CK#) U4.M2(PS_DDR_CKN_502)
DDR_CKP: R51.1 U3.J7(CK) U4.L2(PS_DDR_CKP_502)
DDR_CS: R54.1 U3.L2(CS#) U4.N1(PS_DDR_CS_B_502)
DDR_DM0: U3.E7(LDM) U4.A1(PS_DDR_DM0_502)
DDR_DM1: U3.D3(UDM) U4.F1(PS_DDR_DM1_502)
DDR_DQ0: U3.E3(DQ0) U4.A4(PS_DDR_DQ3_502)
DDR_DQ1: U3.F7(DQ1) U4.B3(PS_DDR_DQ1_502)
DDR_DQ2: U3.F2(DQ2) U4.A2(PS_DDR_DQ2_502)
DDR_DQ3: U3.F8(DQ3) U4.C1(PS_DDR_DQ6_502)
DDR_DQ4: U3.H3(DQ4) U4.D3(PS_DDR_DQ4_502)
DDR_DQ5: U3.H8(DQ5) U4.D1(PS_DDR_DQ5_502)
DDR_DQ6: U3.G2(DQ6) U4.C3(PS_DDR_DQ0_502)
DDR_DQ7: U3.H7(DQ7) U4.E1(PS_DDR_DQ7_502)
DDR_DQ8: U3.B8(DQ14) U4.E2(PS_DDR_DQ8_502)
DDR_DQ9: U3.A7(DQ12) U4.E3(PS_DDR_DQ9_502)
DDR_DQ10: U3.C8(DQ10) U4.G3(PS_DDR_DQ10_502)
DDR_DQ11: U3.D7(DQ8) U4.H3(PS_DDR_DQ11_502)
DDR_DQ12: U3.C2(DQ11) U4.J3(PS_DDR_DQ12_502)
DDR_DQ13: U3.A3(DQ15) U4.H2(PS_DDR_DQ13_502)
DDR_DQ14: U3.C3(DQ9) U4.H1(PS_DDR_DQ14_502)
DDR_DQ15: U3.A2(DQ13) U4.J1(PS_DDR_DQ15_502)
DDR_DQS0_N: U3.G3(LDQS#) U4.B2(PS_DDR_DQS_N0_502)
DDR_DQS0_P: U3.F3(LDQS) U4.C2(PS_DDR_DQS_P0_502)
DDR_DQS1_N: U3.B7(UDQS#) U4.F2(PS_DDR_DQS_N1_502)
DDR_DQS1_P: U3.C7(UDQS) U4.G2(PS_DDR_DQS_P1_502)
DDR_ODT: R50.1 U3.K1(ODT) U4.N5(PS_DDR_ODT_502)
DDR_RAS: R57.1 U3.J3(RAS#) U4.P4(PS_DDR_RAS_B_502)
DDR_RESET: R76.2 U3.T2(RESET#) U4.B4(PS_DDR_DRST_B_502)
DDR_WE: R40.1 U3.L3(WE#) U4.M5(PS_DDR_WE_B_502)
NetR24_2: R24.2 U4.G5(PS_DDR_VRN_502)
NetR27_2: R27.2 U4.H5(PS_DDR_VRP_502)
NetR77_2: R77.2 U3.L8(ZQ)

Not connected (* = marked no-connect by the designer): U3 J1(NC)* J9(NC)* L1(NC)* L9(NC)* M7(NC)*; U4 P1(PS_DDR_DQ16_502) P3(PS_DDR_DQ17_502) R1(PS_DDR_DQ19_502) R2(PS_DDR_DQS_P2_502) R3(PS_DDR_DQ18_502) T1(PS_DDR_DM2_502) T2(PS_DDR_DQS_N2_502) T4(PS_DDR_DQ20_502) U2(PS_DDR_DQ22_502) U3(PS_DDR_DQ23_502) U4(PS_DDR_DQ21_502) V1(PS_DDR_DQ24_502) V2(PS_DDR_DQ30_502) V3(PS_DDR_DQ31_502) W1(PS_DDR_DQ26_502) W3(PS_DDR_DQ29_502) W4(PS_DDR_DQS_N3_502) W5(PS_DDR_DQS_P3_502) Y1(PS_DDR_DM3_502) Y2(PS_DDR_DQ28_502) Y3(PS_DDR_DQ25_502) Y4(PS_DDR_DQ27_502)

### Layout directives
mark named DNP: DDR_A0, DDR_A1, DDR_A2, DDR_A3, DDR_A4, DDR_A5, DDR_A6, DDR_A7, DDR_A8, DDR_A9, DDR_A10, DDR_A11, DDR_A12, DDR_A13, DDR_A14, DDR_BA0, DDR_BA1, DDR_BA2, DDR_CAS, DDR_CKE, DDR_CKN, DDR_CKP, DDR_CS, DDR_ODT, DDR_RAS, DDR_WE, VTTREF

### Library data of the parts
C18 C19 = C: 无极性贴片电容; 版权归属: 源创客; BOM名称: 无极性贴片电容; 学习资源: www.ooocke.com
R21-R24 R27 R31 R35 R36 R38-R57 R76 R77 R79 = R: 贴片电阻; 版权归属: 源创客; BOM名称: 贴片电阻; 学习资源: www.ooocke.com
U3 = CMP-2000-04968-1: 4 Gb DDR3-1600 SDRAM, 256 Mb x 16, 1.25 ns, 1.5 V, 0 to 95 degC, 96-Ball FBGA, Pb-Free; Manufacturer: Micron; Operating Supply Voltage: 1.5V; Address Bus Width: 18Bit; Density: 4Gb; Data Bus Width: 16Bit; Maximum Clock Rate: 1600MHz; Rad Hard: No; Package: 96FBGA; Operating Temperature: 0to95degC; Package Description: 96-Ball Fine-Pitch Ball Grid Array, Body 14 x 9 mm, Pitch 0.8 mm; Package Reference: HA-96; Manufacturer URL: https://www.micron.com/; Datasheet URL: http://passthrough.fw-notify.net/download/888500/http://download.siliconexpert.com/pdfs/2013/4/14/9/8/34/442/mic_/manual/234gb_ddr3_sdram.pdf; Datasheet Version: Rev. M, 04/2013; Number of Bits per Word: 16Bit; Type: DDR3SDRAM
U4 = CMP-0363-00008-3: as U4 on sheet CoreBoard; PartNumber: XC7Z010-1CLG400I; Mounting Technology: Surface Mount; ComponentLink5URL: http://www.xilinx.com/support/documentation/user_guides/ug865-Zynq-7000-Pkg-Pinout.pdf; ComponentLink3URL: http://www.xilinx.com/support/documentation/data_sheets/ds187-XC7Z010-XC7Z020-Data-Sheet.pdf; PackageVersion: Rev 1.1, 09/2012; ComponentLink2Description: Package Specification; ComponentLink4Description: Package File; ComponentLink2URL: http://www.xilinx.com/support/documentation/user_guides/ug865-Zynq-7000-Pkg-Pinout.pdf; ComponentLink3Description: DC and AC Switching Characteristics; ComponentLink6Description: PCB and Layout Guide; ComponentLink4URL: http://www.xilinx.com/support/packagefiles/z7packages/xc7z010clg400pkg.txt; ComponentLink1URL: http://www.xilinx.com/support/documentation/data_sheets/ds190-Zynq-7000-Overview.pdf; Generic Part Number: XC7Z010; PackageReference: CLG400; ComponentLink1Description: Datasheet; RoHS: Pb-Free; ComponentLink6URL: http://www.xilinx.com/support/documentation/user_guides/ug483_7Series_PCB.pdf; DatasheetVersion: v1.2; PackageDescription: Wire-Bond Chip-Scale BGA, Body 17 x 17 mm, 0.8 mm Pitch; ComponentLink5Description: Packaging and Pinout; Code_JEDEC: MO-275-MMAA-1

## Sheet Power.SchDoc
size C; SheetNumber: 4; SheetTotal: 5
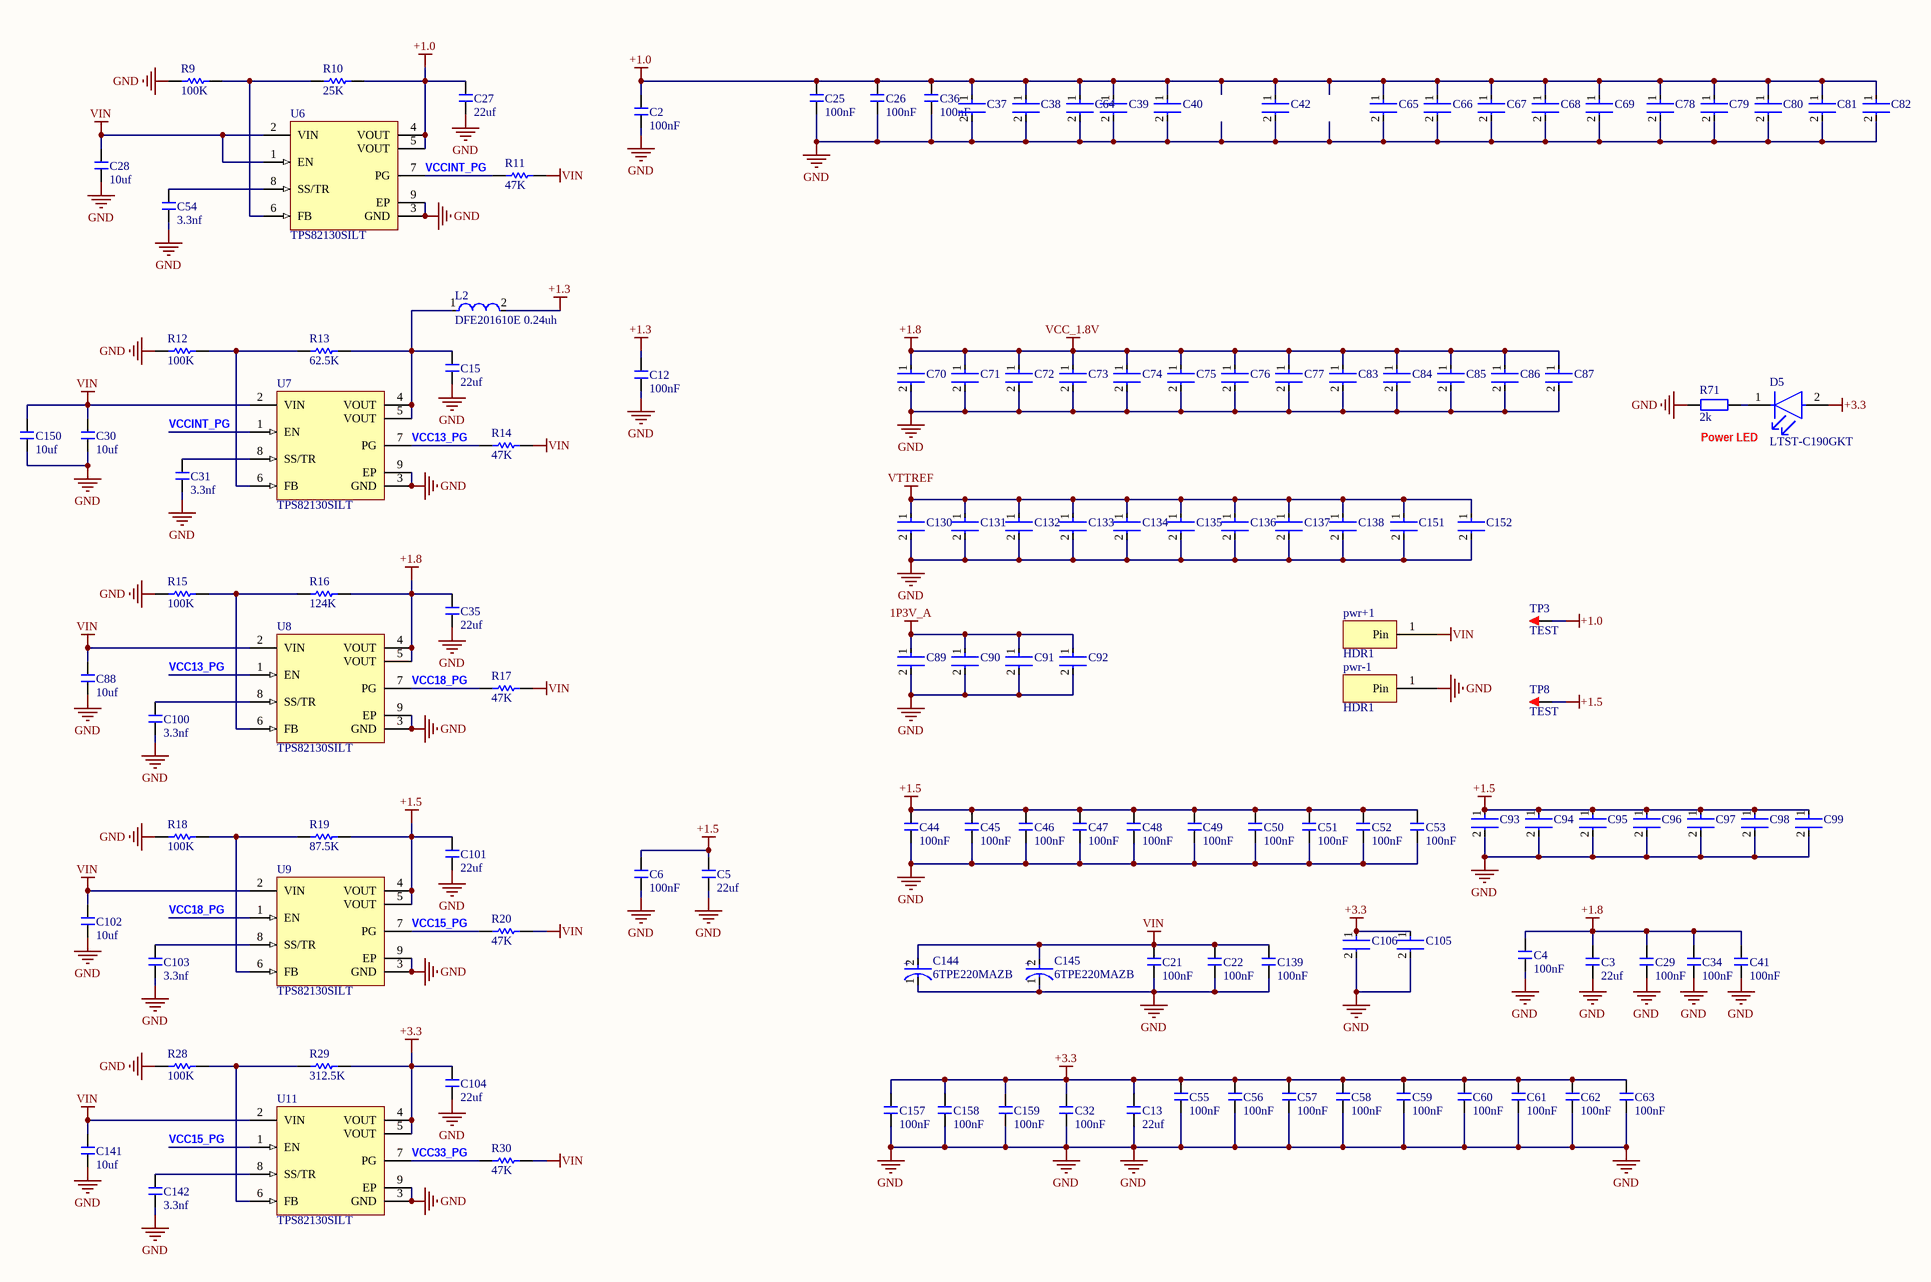
[diagram p4: Power.SchDoc]

### Parts
C2  100nF  [CAP_0402]
C3  22uf  [CAP_0603]
C4  100nF  [CAP_0402]
C5  22uf  [CAP_0603]
C6  100nF  [CAP_0402]
C12  100nF  [CAP_0402]
C13  22uf  [CAP_0603]
C15  22uf  [CAP_0603]
C21  100nF  [CAP_0402]
C22  100nF  [CAP_0402]
C25  100nF  [CAP_0402]
C26  100nF  [CAP_0402]
C27  22uf  [CAP_0603]
C28  10uf  [CAP_0603]
C29  100nF  [CAP_0201]
C30  10uf  [CAP_0603]
C31  3.3nf  [CAP_0402]
C32  100nF  [CAP_0201]
C34  100nF  [CAP_0201]
C35  22uf  [CAP_0603]
C36  100nF  [CAP_0402]
C37  GRM033R61A104KE15D  [FP-GRM033-0_03-IPC_C]  (value not drawn)
C38  GRM033R61A104KE15D  [FP-GRM033-0_03-IPC_C]  (value not drawn)
C39  GRM033R61A104KE15D  [FP-GRM033-0_03-IPC_C]  (value not drawn)
C40  GRM033R61A104KE15D  [FP-GRM033-0_03-IPC_C]  (value not drawn)
C41  100nF  [CAP_0201]
C42  GRM033R61A104KE15D  [FP-GRM033-0_03-IPC_C]  (value not drawn)
C44  100nF  [CAP_0402]
C45  100nF  [CAP_0402]
C46  100nF  [CAP_0402]
C47  100nF  [CAP_0402]
C48  100nF  [CAP_0402]
C49  100nF  [CAP_0402]
C50  100nF  [CAP_0402]
C51  100nF  [CAP_0402]
C52  100nF  [CAP_0402]
C53  100nF  [CAP_0402]
C54  3.3nf  [CAP_0402]
C55  100nF  [CAP_0402]
C56  100nF  [CAP_0402]
C57  100nF  [CAP_0402]
C58  100nF  [CAP_0402]
C59  100nF  [CAP_0201]
C60  100nF  [CAP_0201]
C61  100nF  [CAP_0201]
C62  100nF  [CAP_0402]
C63  100nF  [CAP_0402]
C64  GRM033R61A104KE15D  [FP-GRM033-0_03-IPC_C]  (value not drawn)
C65  GRM033R61A104KE15D  [FP-GRM033-0_03-IPC_C]  (value not drawn)
C66  GRM033R61A104KE15D  [FP-GRM033-0_03-IPC_C]  (value not drawn)
C67  GRM033R61A104KE15D  [FP-GRM033-0_03-IPC_C]  (value not drawn)
C68  GRM033R61A104KE15D  [FP-GRM033-0_03-IPC_C]  (value not drawn)
C69  GRM033R61A104KE15D  [FP-GRM033-0_03-IPC_C]  (value not drawn)
C70  GRM033R61A104KE15D  [FP-GRM033-0_03-IPC_C]  (value not drawn)
C71  GRM033R61A104KE15D  [FP-GRM033-0_03-IPC_C]  (value not drawn)
C72  GRM033R61A104KE15D  [FP-GRM033-0_03-IPC_C]  (value not drawn)
C73  GRM033R61A104KE15D  [FP-GRM033-0_03-IPC_C]  (value not drawn)
C74  GRM033R61A104KE15D  [FP-GRM033-0_03-IPC_C]  (value not drawn)
C75  GRM033R61A104KE15D  [FP-GRM033-0_03-IPC_C]  (value not drawn)
C76  GRM033R61A104KE15D  [FP-GRM033-0_03-IPC_C]  (value not drawn)
C77  GRM033R61A104KE15D  [FP-GRM033-0_03-IPC_C]  (value not drawn)
C78  GRM033R61A104KE15D  [FP-GRM033-0_03-IPC_C]  (value not drawn)
C79  GRM033R61A104KE15D  [FP-GRM033-0_03-IPC_C]  (value not drawn)
C80  GRM033R61A104KE15D  [FP-GRM033-0_03-IPC_C]  (value not drawn)
C81  GRM033R61A104KE15D  [FP-GRM033-0_03-IPC_C]  (value not drawn)
C82  GRM033R61A104KE15D  [FP-GRM033-0_03-IPC_C]  (value not drawn)
C83  GRM033R61A104KE15D  [FP-GRM033-0_03-IPC_C]  (value not drawn)
C84  GRM033R61A104KE15D  [FP-GRM033-0_03-IPC_C]  (value not drawn)
C85  GRM033R61A104KE15D  [FP-GRM033-0_03-IPC_C]  (value not drawn)
C86  GRM033R61A104KE15D  [FP-GRM033-0_03-IPC_C]  (value not drawn)
C87  GRM033R61A104KE15D  [FP-GRM033-0_03-IPC_C]  (value not drawn)
C88  10uf  [CAP_0603]
C89  GRM033R61A104KE15D  [FP-GRM033-0_03-IPC_C]  (value not drawn)
C90  GRM033R61A104KE15D  [FP-GRM033-0_03-IPC_C]  (value not drawn)
C91  GRM033R61A104KE15D  [FP-GRM033-0_03-IPC_C]  (value not drawn)
C92  GRM033R61A104KE15D  [FP-GRM033-0_03-IPC_C]  (value not drawn)
C93  GRM033R61A104KE15D  [FP-GRM033-0_03-IPC_C]  (value not drawn)
C94  GRM033R61A104KE15D  [FP-GRM033-0_03-IPC_C]  (value not drawn)
C95  GRM033R61A104KE15D  [FP-GRM033-0_03-IPC_C]  (value not drawn)
C96  GRM033R61A104KE15D  [FP-GRM033-0_03-IPC_C]  (value not drawn)
C97  GRM033R61A104KE15D  [FP-GRM033-0_03-IPC_C]  (value not drawn)
C98  GRM033R61A104KE15D  [FP-GRM033-0_03-IPC_C]  (value not drawn)
C99  GRM033R61A104KE15D  [FP-GRM033-0_03-IPC_C]  (value not drawn)
C100  3.3nf  [CAP_0402]
C101  22uf  [CAP_0603]
C102  10uf  [CAP_0603]
C103  3.3nf  [CAP_0402]
C104  22uf  [CAP_0603]
C105  GRM033R61A104KE15D  [FP-GRM033-0_03-IPC_C]  (value not drawn)
C106  GRM033R61A104KE15D  [FP-GRM033-0_03-IPC_C]  (value not drawn)
C130  GRM033R61A104KE15D  [FP-GRM033-0_03-IPC_C]  (value not drawn)
C131  GRM033R61A104KE15D  [FP-GRM033-0_03-IPC_C]  (value not drawn)
C132  GRM033R61A104KE15D  [FP-GRM033-0_03-IPC_C]  (value not drawn)
C133  GRM033R61A104KE15D  [FP-GRM033-0_03-IPC_C]  (value not drawn)
C134  GRM033R61A104KE15D  [FP-GRM033-0_03-IPC_C]  (value not drawn)
C135  GRM033R61A104KE15D  [FP-GRM033-0_03-IPC_C]  (value not drawn)
C136  GRM033R61A104KE15D  [FP-GRM033-0_03-IPC_C]  (value not drawn)
C137  GRM033R61A104KE15D  [FP-GRM033-0_03-IPC_C]  (value not drawn)
C138  GRM033R61A104KE15D  [FP-GRM033-0_03-IPC_C]  (value not drawn)
C139  100nF  [CAP_0402]
C141  10uf  [CAP_0603]
C142  3.3nf  [CAP_0402]
C144  6TPE220MAZB  [FP-TPEB2-MFG]
C145  6TPE220MAZB  [FP-TPEB2-MFG]
C150  10uf  [CAP_0603]
C151  GRM033R61A104KE15D  [FP-GRM033-0_03-IPC_C]  (value not drawn)
C152  GRM033R61A104KE15D  [FP-GRM033-0_03-IPC_C]  (value not drawn)
C157  100nF  [CAP_0201]
C158  100nF  [CAP_0201]
C159  100nF  [CAP_0201]
D5  LTST-C190GKT  [FP-LTST-C190GKT-MFG]
L2  DFE201610E 0.24uh  [FP-DFE201610C-MFG]
pwr+1  HDR1  [HDR1]
pwr-1  HDR1  [HDR1]
R9  100K  [RES_0402]
R10  25K  [RES_0402]
R11  47K  [RES_0402]
R12  100K  [RES_0402]
R13  62.5K  [RES_0402]
R14  47K  [RES_0402]
R15  100K  [RES_0402]
R16  124K  [RES_0402]
R17  47K  [RES_0402]
R18  100K  [RES_0402]
R19  87.5K  [RES_0402]
R20  47K  [RES_0402]
R28  100K  [RES_0402]
R29  312.5K  [RES_0402]
R30  47K  [RES_0402]
R71  2k  [RES_0402]
TP3  TEST  [TEST 0.8]
TP8  TEST  [TEST 0.8]
U6  TPS82130SILT  [SIL0008D_V]
U7  TPS82130SILT  [SIL0008D_V]
U8  TPS82130SILT  [SIL0008D_V]
U9  TPS82130SILT  [SIL0008D_V]
U11  TPS82130SILT  [SIL0008D_V]

### Nets
1P3V_A: C89.1 C90.1 C91.1 C92.1
+1.0: C2.1 C25.1 C26.1 C27.2 C36.1 C37.1 C38.1 C39.1 C40.1 C42.1 C64.1 C65.1 C66.1 C67.1 C68.1 C69.1 C78.1 C79.1 C80.1 C81.1 C82.1 R10.1 TP3.1 U6.4(VOUT) U6.5(VOUT)
+1.3: C12.1 L2.2
+1.5: C5.2 C6.1 C44.1 C45.1 C46.1 C47.1 C48.1 C49.1 C50.1 C51.1 C52.1 C53.1 C93.1 C94.1 C95.1 C96.1 C97.1 C98.1 C99.1 C101.2 R19.1 TP8.1 U9.4(VOUT) U9.5(VOUT)
+1.8: C3.2 C4.1 C29.1 C34.1 C35.2 C41.1 C70.1 C71.1 C72.1 C73.1 C74.1 C75.1 C76.1 C77.1 C83.1 C84.1 C85.1 C86.1 C87.1 R16.1 U8.4(VOUT) U8.5(VOUT)  [also labelled VCC_1.8V]
+3.3: C13.2 C32.1 C55.1 C56.1 C57.1 C58.1 C59.1 C60.1 C61.1 C62.1 C63.1 C104.2 C105.1 C106.1 C157.1 C158.1 C159.1 D5.2(A) R29.1 U11.4(VOUT) U11.5(VOUT)
GND: C2.2 C3.1 C4.2 C5.1 C6.2 C12.2 C13.1 C15.1 C21.2 C22.2 C25.2 C26.2 C27.1 C28.1 C29.2 C30.1 C31.1 C32.2 C34.2 C35.1 C36.2 C37.2 C38.2 C39.2 C40.2 C41.2 C42.2 C44.2 C45.2 C46.2 C47.2 C48.2 C49.2 C50.2 C51.2 C52.2 C53.2 C54.1 C55.2 C56.2 C57.2 C58.2 C59.2 C60.2 C61.2 C62.2 C63.2 C64.2 C65.2 C66.2 C67.2 C68.2 C69.2 C70.2 C71.2 C72.2 C73.2 C74.2 C75.2 C76.2 C77.2 C78.2 C79.2 C80.2 C81.2 C82.2 C83.2 C84.2 C85.2 C86.2 C87.2 C88.1 C89.2 C90.2 C91.2 C92.2 C93.2 C94.2 C95.2 C96.2 C97.2 C98.2 C99.2 C100.1 C101.1 C102.1 C103.1 C104.1 C105.2 C106.2 C130.2 C131.2 C132.2 C133.2 C134.2 C135.2 C136.2 C137.2 C138.2 C139.2 C141.1 C142.1 C144.1(C) C145.1(C) C150.1 C151.2 C152.2 C157.2 C158.2 C159.2 pwr-1.1(Pin) R9.2 R12.2 R15.2 R18.2 R28.2 R71.1 U6.3(GND) U6.9(EP) U7.3(GND) U7.9(EP) U8.3(GND) U8.9(EP) U9.3(GND) U9.9(EP) U11.3(GND) U11.9(EP)
VIN: C21.1 C22.1 C28.2 C30.2 C88.2 C102.2 C139.1 C141.2 C144.2(A) C145.2(A) C150.2 pwr+1.1(Pin) R11.1 R14.1 R17.1 R20.1 R30.1 U6.1(EN) U6.2(VIN) U7.2(VIN) U8.2(VIN) U9.2(VIN) U11.2(VIN)
VTTREF: C130.1 C131.1 C132.1 C133.1 C134.1 C135.1 C136.1 C137.1 C138.1 C151.1 C152.1
VCC13_PG: R14.2 U7.7(PG) U8.1(EN)
VCC15_PG: R20.2 U9.7(PG) U11.1(EN)
VCC18_PG: R17.2 U8.7(PG) U9.1(EN)
VCC33_PG: R30.2 U11.7(PG)
VCCINT_PG: R11.2 U6.7(PG) U7.1(EN)
NetC15_2: C15.2 L2.1 R13.1 U7.4(VOUT) U7.5(VOUT)
NetC31_2: C31.2 U7.8(SS/TR)
NetC54_2: C54.2 U6.8(SS/TR)
NetC100_2: C100.2 U8.8(SS/TR)
NetC103_2: C103.2 U9.8(SS/TR)
NetC142_2: C142.2 U11.8(SS/TR)
NetD5_1: D5.1(C) R71.2
NetR9_1: R9.1 R10.2 U6.6(FB)
NetR12_1: R12.1 R13.2 U7.6(FB)
NetR15_1: R15.1 R16.2 U8.6(FB)
NetR18_1: R18.1 R19.2 U9.6(FB)
NetR28_1: R28.1 R29.2 U11.6(FB)

### Notes on the sheet
- Power LED
- (in symbol CMP-05429-000001-1) +

### Library data of the parts
C2-C6 C12 C13 C15 C21 C22 C25-C32 C34-C36 C41 C44-C63 C88 C100-C104 C139 C141 C142 C150 C157-C159 = C: 无极性贴片电容; 版权归属: 源创客; BOM名称: 无极性贴片电容; 学习资源: www.ooocke.com
C37-C40 C42 C64-C87 C89-C99 C105 C106 C130-C138 C151 C152 = CMP-2010-01264-2: Chip Multilayer Ceramic Capacitors for General Purpose, 0201, 0.10uF, X5R, 15%, 10%, 10V; Capacitance: 100nF; Mount: Surface Mount; Dielectric: X5R; Width: 0.012inch; Tolerance: 10%; Radiation Hardening: No; Voltage Rating: 10V; REACH SVHC: No SVHC; Height: 0.3mm; Max Operating Temperature: 85°C; Voltage Rating (DC): 10V; Thickness: 0.013inch; Termination: SMD/SMT; Lead Free: Lead Free; Package Quantity: 1; Case/Package: 0201; Min Operating Temperature: -55°C; Weight: 6E-06oz; Length: 0.6mm; Case Code (Imperial): 0201; Depth: 0.3mm; Voltage: 10V; Packaging: Tape and Reel; Case Code (Metric): 0603
C144 C145 = CMP-05429-000001-1: CAP TANT POLY 220UF 6.3V 1411; Leakage Current: 138.6uA; Polarity: Polar; Ripple Current: 1.4A; ESR (Equivalent Series Resistance): 35mR; Tolerance: 20%; Dissipation Factor: 10%; Number of Pins: 2; REACH SVHC: No SVHC; Case Code (Imperial): 1411; Min Operating Temperature: -55°C; Voltage Rating: 6.3V; Radiation Hardening: No; Lead Free: Lead Free; Case Code (Metric): 3528; Length: 3.5mm; Depth: 2.8mm; Case/Package: Molded; Width: 0.11inch; Voltage Rating (DC): 6.3V; Features: General Purpose; Max Operating Temperature: 105°C; Capacitance: 220uF; Height - Seated (Max): 0.079inch; Voltage: 6.3V; Termination: SMD/SMT; Height: 1.9mm; Package Quantity: 2000; Mount: Surface Mount; Packaging: Tape and Reel
D5 = CMP-22017-000005-2: as D1 on sheet CoreBoard; Min Operating Temperature: -55°C; Lens Style: Clear; Mount: Surface Mount; Width: 0.8mm; Packaging: Tape and Reel; Lens Transparency: Clear; Case Code (Metric): 1608; Depth: 0.8mm; Case Code (Imperial): 0603; Case/Package: 0603; Number of Pins: 2; Max Operating Temperature: 85°C; Lead Free: Lead Free; Number of Elements: 1; Length: 1.6mm; Height: 0.8mm; Package Quantity: 1; Power Rating: 100mW; Radiation Hardening: No; Illumination Color: Green; Color: Green
L2 = CMP-06042-015199-1: 0.24uh
R9-R20 R28-R30 = RES
R71 = R: 贴片电阻; 版权归属: 源创客; BOM名称: 贴片电阻; 学习资源: www.ooocke.com
TP3 TP8 = TEST: 测试点; 版权归属: 源创客; BOM名称: 测试点; 学习资源: www.ooocke.com
U6-U9 U11 = CMP-2000-07569-1: Step-Down Converter MicroSiP(TM) Module with Integrated Inductor, 3 A, 3 to 17 V, -40 to 125 degC, 8-Pin uSiP (SIL), Tape and Reel; Manufacturer: Texas Instruments; Quiescent Current: 20uA; Output Voltage: 5V; Output Current: 3A; Max Input Voltage: 17V; Switching Frequency: 2MHz; Min Output Voltage: 900mV; Number of Outputs: 1; Min Input Voltage: 3V; Datasheet URL: http://www.ti.com/lit/ds/symlink/tps82130.pdf; Packaging: CutTape; Datasheet Version: Rev. C, 01/2017; Package Reference: SIL0008D; Case/Package: SMD/SMT; Manufacturer URL: http://www.ti.com/; Length: 0.12inch; Lead Free: LeadFree; Mount: SurfaceMount; Number of Pins: 8; Package Description: 8-Pin Single In-line Package, Body 3 x 2.8 mm, Pitch 0.65 mm; Max Output Voltage: 5V; Mounting Technology: SurfaceMount; Height: 0.06inch; Max Operating Temperature: 125degC; Width: 0.11inch; Min Operating Temperature: -40degC; Voltage - Output 1: 5V; RoHSCompliant: True; REACH SVHC: NoSVHC; Max Output Current: 3A

## Sheet RFFE.SchDoc
size A; SheetNumber: 5; SheetTotal: 5
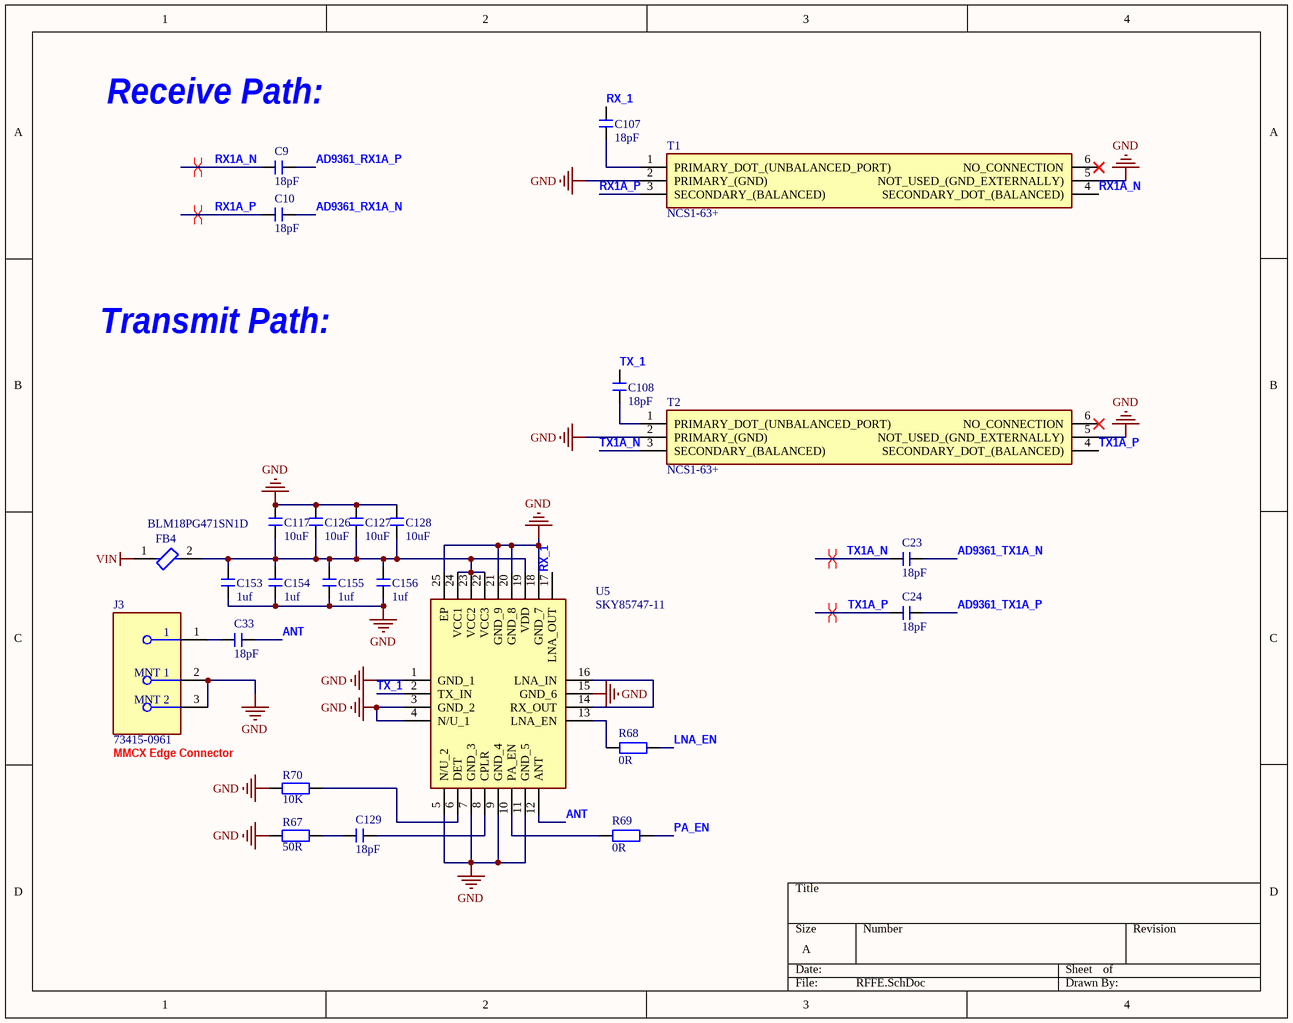
[diagram p5: RFFE.SchDoc]

### Parts
C9  18pF  [CAP_0201]
C10  18pF  [CAP_0201]
C23  18pF  [CAP_0201]
C24  18pF  [CAP_0201]
C33  18pF  [CAP_0201]
C107  18pF  [CAP_0201]
C108  18pF  [CAP_0201]
C117  10uF  [CAP_0402]
C126  10uF  [CAP_0402]
C127  10uF  [CAP_0402]
C128  10uF  [CAP_0402]
C129  18pF  [CAP_0201]
C153  1uf  [CAP_0201]
C154  1uf  [CAP_0201]
C155  1uf  [CAP_0201]
C156  1uf  [CAP_0201]
FB4  BLM18PG471SN1D  [FP-BLM18-0_15-t0_8-MFG]
J3  73415-0961  [FP-73415-0961-MFG]
R67  value 50R  [RES_0201]  (hidden comment: Resistor)
R68  0R  [RES_0402]
R69  0R  [RES_0402]
R70  value 10K  [RES_0201]  (hidden comment: Resistor)
T1  NCS1-63+  [NCS163]
T2  NCS1-63+  [NCS163]
U5  SKY85747-11  [SKY8574711]

### Nets
GND: C117.2 C126.2 C127.2 C128.2 C153.1 C154.1 C155.1 C156.1 J3.2(MNT_1) J3.3(MNT_2) R67.2 R70.2 T1.2(PRIMARY_(GND)) T1.5(NOT_USED_(GND_EXTERNALLY)) T2.2(PRIMARY_(GND)) T2.5(NOT_USED_(GND_EXTERNALLY)) U5.1(GND_1) U5.3(GND_2) U5.4(N/U_1) U5.5(N/U_2) U5.7(GND_3) U5.9(GND_4) U5.11(GND_5) U5.15(GND_6) U5.18(GND_7) U5.20(GND_8) U5.21(GND_9) U5.25(EP)
VIN: FB4.1
AD9361_RX1A_N: C10.2
AD9361_RX1A_P: C9.2
AD9361_TX1A_N: C23.2
AD9361_TX1A_P: C24.2
ANT: C33.2 U5.12(ANT)
LNA_EN: R68.1
PA_EN: R69.1
RX1A_N: C9.1 T1.4(SECONDARY_DOT_(BALANCED))
RX1A_P: C10.1 T1.3(SECONDARY_(BALANCED))
RX_1: C107.2 U5.17(LNA_OUT)
TX1A_N: C23.1 T2.3(SECONDARY_(BALANCED))
TX1A_P: C24.1 T2.4(SECONDARY_DOT_(BALANCED))
TX_1: C108.2 U5.2(TX_IN)
NetC33_1: C33.1 J3.1
NetC107_1: C107.1 T1.1(PRIMARY_DOT_(UNBALANCED_PORT))
NetC108_1: C108.1 T2.1(PRIMARY_DOT_(UNBALANCED_PORT))
NetC117_1: C117.1 C126.1 C127.1 C128.1 C153.2 C154.2 C155.2 C156.2 FB4.2 U5.19(VDD) U5.22(VCC3) U5.23(VCC2) U5.24(VCC1)
NetC129_1: C129.1 R67.1
NetC129_2: C129.2 U5.8(CPLR)
NetR68_2: R68.2 U5.13(LNA_EN)
NetR69_2: R69.2 U5.10(PA_EN)
NetR70_1: R70.1 U5.6(DET)
NetU5_14: U5.14(RX_OUT) U5.16(LNA_IN)

Not connected (* = marked no-connect by the designer): T1 6(NO_CONNECTION)*; T2 6(NO_CONNECTION)*

### Layout directives
differential pair: RX1A_N, RX1A_P, TX1A_N, TX1A_P

### Notes on the sheet
- Receive Path:
- Transmit Path:
- MMCX Edge Connector

### Library data of the parts
C9 C10 C23 C24 C33 C107 C108 C117 C126-C129 C153-C156 = C: 无极性贴片电容; 版权归属: 源创客; BOM名称: 无极性贴片电容; 学习资源: www.ooocke.com
FB4 = CMP-0686-00587-3: Chip Ferrite Bead, 0603, 470Ω @ 100MHz, 0.2Ω, 25%, 1A; DC Resistance (DCR): 200mR; Number of Circuits: 1; Material: Steel; Impedance: 470R; Core Material: Ferrite; Width: 0.8mm; Termination: SMD/SMT; Series: BLM18P; Min Operating Temperature: -55°C; DC Resistance-Max: 200mR; Current Rating: 1A; Package Quantity: 1; Max Operating Temperature: 125°C; Military Standard: Not; REACH SVHC: No SVHC; Max Current Rating: 1A; Number of Pins: 2; RoHS Compliant: Yes; Tolerance: 25%; Packaging: Tape and Reel; Number of Lines: 1; Resistance: 200mR; Length: 1.6mm; Case Code (Metric): 1608; Depth: 0.8mm; Lead Free: Lead Free; Case/Package: 0603; Height: 0.8mm; Radiation Hardening: No; Test Frequency: 100MHz; Case Code (Imperial): 0603; Max DC Current: 1A; DC Current: 1A
J3 = CMP-00257-01481145-1: 73415-0961 RF MMCX Connector, 1 Contact(s), Female, Board Mount, Surface Mount Terminal, Receptacle; Plating: Gold; Voltage Rating: 170V; Impedance: 50Ω; Frequency: 6GHz; Connector Type: Coaxial, Connector, MMCX; Insulation Resistance: 10GΩ; Min Operating Temperature: -55°C; Mount: Edge; REACH SVHC: Unknown; Max Frequency: 6GHz; Termination: Solder; Contact Material: Copper; Max Operating Temperature: 155°C; Contact Plating: Gold; NexarPartId: 1481145; Lead Free: Lead Free; Gender: Female; Body Plating: Gold; Halogen Free: Low Halogen; Radiation Hardening: No; Orientation: Right Angle; Packaging: Bulk; RoHS: Compliant
R68 R69 = R: 贴片电阻; 版权归属: 源创客; BOM名称: 贴片电阻; 学习资源: www.ooocke.com
T1 T2 = NCS1-63+: Transformer; Manufacturer_Name: Mini-Circuits; Datasheet Link: https://www.minicircuits.com/pdfs/NCS1-63+.pdf; Height: 1.0686mm; Manufacturer_Part_Number: NCS1-63+; Mouser Part Number: 139-NCS1-63; Mouser Price/Stock: https://www.mouser.co.uk/ProductDetail/Mini-Circuits/NCS1-63%2b?qs=xZ%2FP%252Ba9zWqbvv4L0HdNEiw%3D%3D
U5 = SKY85747-11: Integrated Circuit; Manufacturer_Name: Skyworks; Datasheet Link: https://www.skyworksinc.com/-/media/D3029C8735D243D49E5D7B71E89CB849.pdf; Height: 1mm; Manufacturer_Part_Number: SKY85747-11; Mouser Part Number: N/A; Mouser Price/Stock: https://www.mouser.co.uk/ProductDetail/Skyworks-Solutions-Inc/SKY85747-11?qs=rkhjVJ6%2F3EJ7jYNOizWTJw%3D%3D

## Nets that join several sheets
1P3V_A: AD9361 (26 pins), Power (C89.1 C90.1 C91.1 C92.1)
+1.0: CoreBoard (17 pins), Power (25 pins)
+1.3: AD9361 (7 pins), Power (C12.1 L2.2)
+1.5: CoreBoard (10 pins), DDRmem (21 pins), Power (24 pins)
+1.8: CoreBoard (29 pins), AD9361 (TP2.1 U1.H12), Power (22 pins)
+3.3: CoreBoard (38 pins), Power (21 pins)
GND: CoreBoard (116 pins), AD9361 (77 pins), DDRmem (26 pins), Power (127 pins), RFFE (28 pins)
VIN: Power (23 pins), RFFE (FB4.1)
VTTREF: DDRmem (32 pins), Power (11 pins)
AD9361_RESET: CoreBoard (U4.G19), AD9361 (R7.1 U1.K5)
AD9361_RX1A_N: AD9361 (U1.M2), RFFE (C10.2)
AD9361_RX1A_P: AD9361 (U1.M1), RFFE (C9.2)
AD9361_TX1A_N: AD9361 (L4.2 U1.M8), RFFE (C23.2)
AD9361_TX1A_P: AD9361 (L1.2 U1.M7), RFFE (C24.2)
CLK_IN_9361: CoreBoard (C146.2), AD9361 (U1.M12)
CLK_OUT_9361: CoreBoard (U4.L16), AD9361 (U1.J6)
CTRL_IN2: CoreBoard (U4.N17), AD9361 (U1.D6)
DATA_CLK_P: CoreBoard (U4.H16), AD9361 (U1.G11)
EN_AGC: CoreBoard (U4.F19), AD9361 (U1.G5)
EN_ENSM: CoreBoard (U4.G20), AD9361 (U1.G6)
FB_CLK_P: CoreBoard (U4.K17), AD9361 (U1.F10)
LNA_EN: CoreBoard (U4.A19), RFFE (R68.1)
PA_EN: CoreBoard (U4.B18), RFFE (R69.1)
RX_D0: CoreBoard (U4.J19), AD9361 (U1.K11)
RX_D1: CoreBoard (U4.M18), AD9361 (U1.J12)
RX_D2: CoreBoard (U4.L20), AD9361 (U1.K10)
RX_D3: CoreBoard (U4.M19), AD9361 (U1.J11)
RX_D4: CoreBoard (U4.G18), AD9361 (U1.K9)
RX_D5: CoreBoard (U4.J18), AD9361 (U1.J10)
RX_D6: CoreBoard (U4.K19), AD9361 (U1.K8)
RX_D7: CoreBoard (U4.K18), AD9361 (U1.J9)
RX_D8: CoreBoard (U4.J20), AD9361 (U1.K7)
RX_D9: CoreBoard (U4.H17), AD9361 (U1.J8)
RX_D10: CoreBoard (U4.H18), AD9361 (U1.J7)
RX_D11: CoreBoard (U4.L19), AD9361 (U1.H8)
RX_FRAME_P: CoreBoard (U4.M20), AD9361 (U1.G8)
SPI_CLK: CoreBoard (U4.D19), AD9361 (U1.J5)
SPI_DI: CoreBoard (U4.E18), AD9361 (U1.J4)
SPI_DO: CoreBoard (U4.D20), AD9361 (U1.L6)
SPI_ENB: CoreBoard (U4.F20), AD9361 (U1.K6)
TX_D0: CoreBoard (U4.J16), AD9361 (U1.E12)
TX_D1: CoreBoard (U4.N15), AD9361 (U1.D11)
TX_D2: CoreBoard (U4.M17), AD9361 (U1.E11)
TX_D3: CoreBoard (U4.N16), AD9361 (U1.D10)
TX_D4: CoreBoard (U4.J14), AD9361 (U1.E10)
TX_D5: CoreBoard (U4.M15), AD9361 (U1.D9)
TX_D6: CoreBoard (U4.L15), AD9361 (U1.E9)
TX_D7: CoreBoard (U4.L14), AD9361 (U1.D8)
TX_D8: CoreBoard (U4.K14), AD9361 (U1.E8)
TX_D9: CoreBoard (U4.M14), AD9361 (U1.D7)
TX_D10: CoreBoard (U4.K16), AD9361 (U1.F8)
TX_D11: CoreBoard (U4.J15), AD9361 (U1.E7)
TX_FRAME_P: CoreBoard (U4.L17), AD9361 (U1.G9)
TXNRX_ENSM: CoreBoard (U4.E19), AD9361 (U1.H4)